# Altium project USB-C Power.PrjPcb (part 1 of 2)
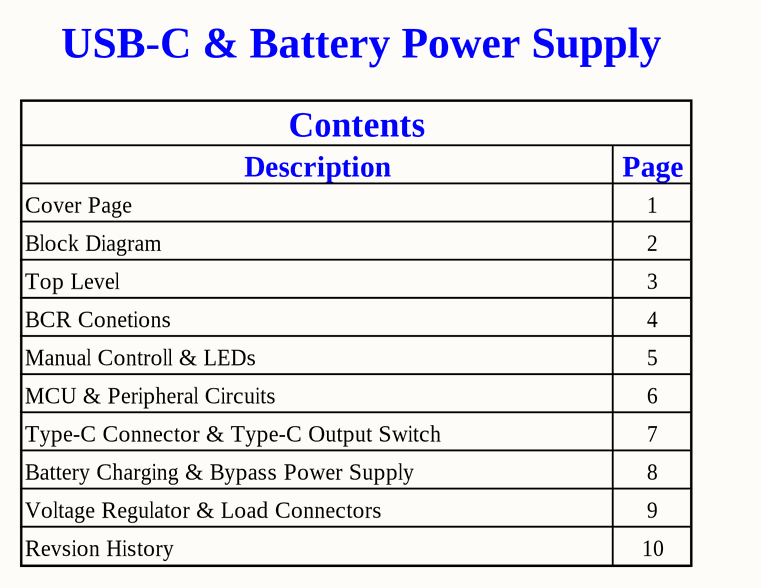
[diagram p0: Cover_Page.SchDoc]
DrawnBy: Yun-Chien Chen; Project: USB-C & Battery Power Supply; Revision: 01
11 sheets, 234 parts. Net scope: hierarchical (ports join the sheet entries above them; power ports are global).
Board file: USB-C Power.PcbDoc
Sheets:
  Cover_Page.SchDoc
  Block_Diagram.SchDoc
  Top_Level.SchDoc
    PD Controll & LEDs = PD_Controll_and_LEDs.SchDoc
    MCU & Peripheral Circuits = MCU_and_Peripheral_Circuits.SchDoc
    Type-C Connector & PD Switch = Type-C_Connector_and_PD_Switch.SchDoc
    PD BCR Connections = PD_BCR_Connections.SchDoc
    Battery & Bypass Controller Connectons = Battery_and_Bypass_Controller_Connectons.SchDoc
    Voltage Regulator & Load Connectors = Voltage_Regulator_and_Load_Connectors.SchDoc
    Battery Charging & Bypass Power Supply = Battery_Charging_and_Bypass_Power_Supply.SchDoc
  Revision_History.SchDoc

## Sheet Cover_Page.SchDoc: Cover Page
size 292 x 193 mm; SheetNumber: 1; SheetTotal: 12; SheetSize: A4

### Notes on the sheet
- USB-C & Battery Power Supply
- Project :
- Size:
- Title:
- Drawn by:
- Variant:
- Rev:
- Date:
- Sheet:
- of

## Sheet Block_Diagram.SchDoc: Block Diagram
size 292 x 193 mm; SheetNumber: 2; SheetTotal: 12; SheetSize: A4

### Notes on the sheet
- Project :
- Size:
- Title:
- Drawn by:
- Variant:
- Rev:
- Date:
- Sheet:
- of

## Sheet Top_Level.SchDoc: Top Level
size 292 x 193 mm; SheetNumber: 3; SheetTotal: 11; SheetSize: A4
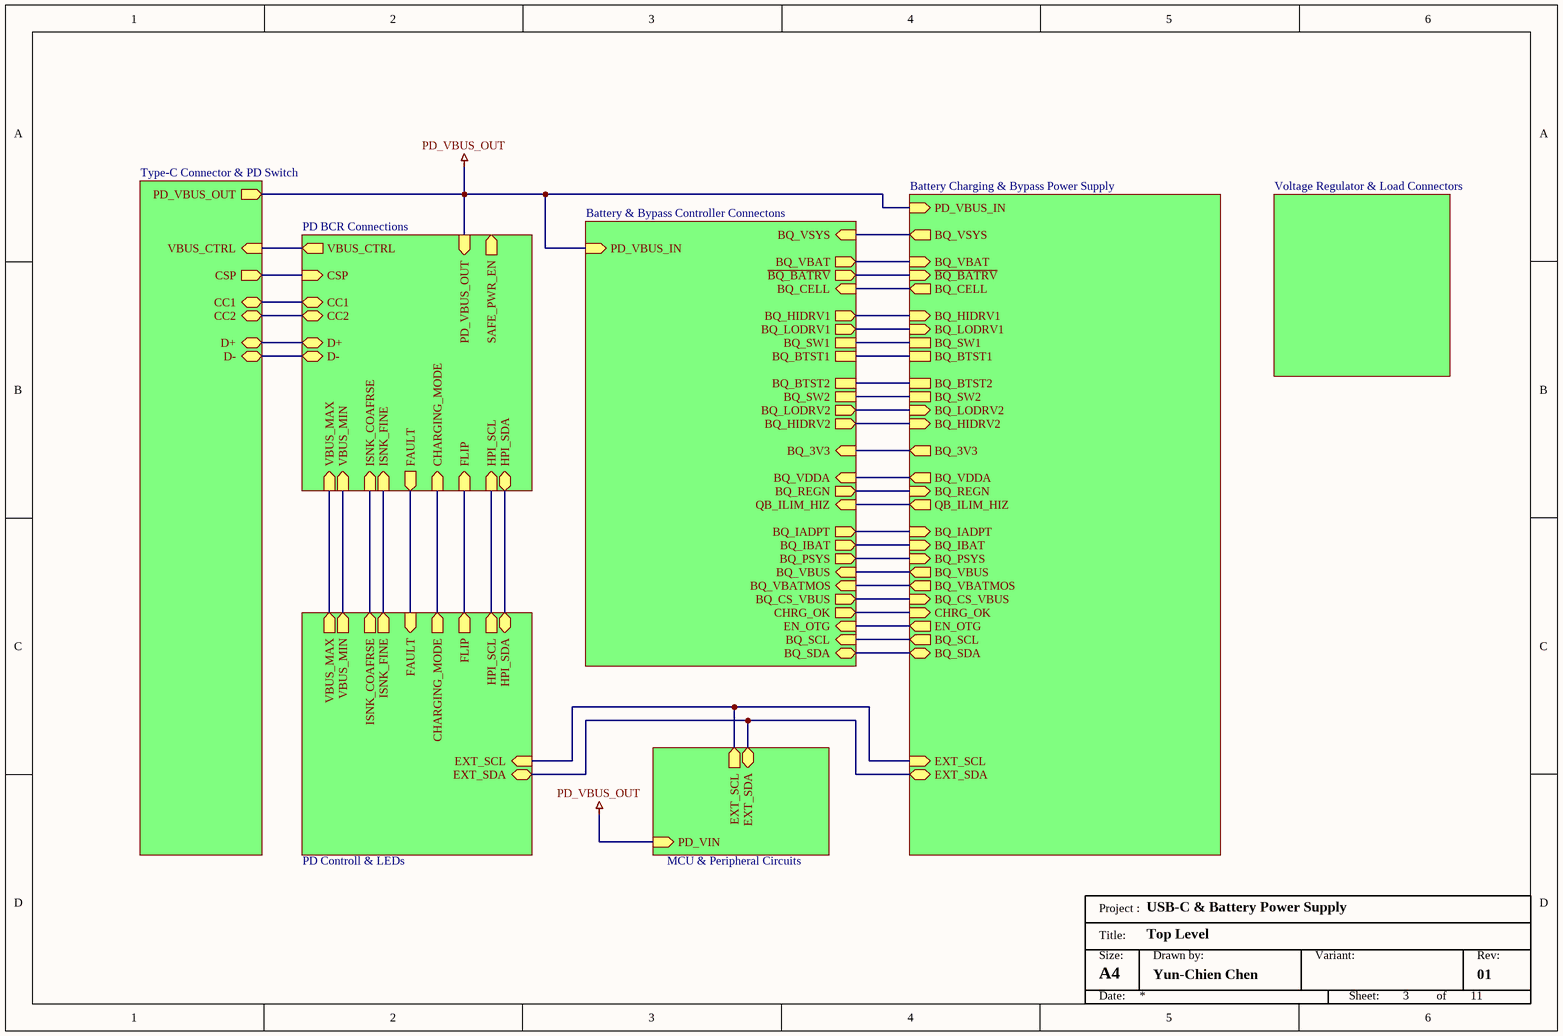
[diagram p1: Top_Level.SchDoc]

### Sub-sheets
Battery & Bypass Controller Connectons = Battery_and_Bypass_Controller_Connectons.SchDoc: CHRG_OK (out), EN_OTG (in), PD_VBUS_IN (in), BQ_3V3 (in), BQ_VDDA (in), QB_ILIM_HIZ (in), BQ_VBUS (in), BQ_IADPT (out), BQ_IBAT (out), BQ_PSYS (out), BQ_REGN (out), BQ_CS_VBUS (out), BQ_HIDRV1 (out), BQ_HIDRV2 (out), BQ_BTST1, BQ_BTST2, BQ_LODRV1 (out), BQ_LODRV2 (out), BQ_SW1, BQ_SW2, BQ_VBAT (out), ~{BQ_BATRV} (out), BQ_VBATMOS (in), BQ_CELL (in), BQ_SDA (bidir), BQ_SCL (in), BQ_VSYS (in)
Battery Charging & Bypass Power Supply = Battery_Charging_and_Bypass_Power_Supply.SchDoc: EXT_SCL (in), EXT_SDA (bidir), BQ_3V3 (out), BQ_VBAT (in), BQ_SCL (out), CHRG_OK (in), EN_OTG (out), QB_ILIM_HIZ (out), PD_VBUS_IN (in), BQ_IADPT (in), BQ_IBAT (in), BQ_PSYS (in), BQ_REGN (in), ~{BQ_BATRV} (in), BQ_VBATMOS (out), BQ_CELL (out), BQ_SDA (bidir), BQ_VDDA (out), BQ_CS_VBUS (in), BQ_HIDRV1 (in), BQ_LODRV1 (in), BQ_SW1, BQ_BTST1, BQ_BTST2, BQ_SW2, BQ_LODRV2 (in), BQ_HIDRV2 (in), BQ_VSYS (out), BQ_VBUS (out)
MCU & Peripheral Circuits = MCU_and_Peripheral_Circuits.SchDoc: EXT_SDA (bidir), PD_VIN (in), EXT_SCL (out)
PD BCR Connections = PD_BCR_Connections.SchDoc: CC1 (bidir), CC2 (bidir), CSP (in), VBUS_CTRL (out), FAULT (out), CHARGING_MODE (in), FLIP (in), VBUS_MAX (in), VBUS_MIN (in), ISNK_FINE (in), ISNK_COAFRSE (in), HPI_SCL (in), HPI_SDA (bidir), D+ (bidir), D- (bidir), PD_VBUS_OUT (in), SAFE_PWR_EN (out)
PD Controll & LEDs = PD_Controll_and_LEDs.SchDoc: CHARGING_MODE (out), EXT_SCL (in), EXT_SDA (bidir), FLIP (out), HPI_SCL (out), HPI_SDA (bidir), VBUS_MAX (out), VBUS_MIN (out), ISNK_FINE (out), ISNK_COAFRSE (out), FAULT (in)
Type-C Connector & PD Switch = Type-C_Connector_and_PD_Switch.SchDoc: D+ (bidir), D- (bidir), CC1 (bidir), CC2 (bidir), VBUS_CTRL (in), PD_VBUS_OUT (out), CSP (out)
Voltage Regulator & Load Connectors = Voltage_Regulator_and_Load_Connectors.SchDoc: no entries

### Nets
BQ_3V3: sheet Battery & Bypass Controller Connectons/BQ_3V3, sheet Battery Charging & Bypass Power Supply/BQ_3V3
BQ_CS_VBUS: sheet Battery & Bypass Controller Connectons/BQ_CS_VBUS, sheet Battery Charging & Bypass Power Supply/BQ_CS_VBUS
PD_VBUS_OUT: sheet MCU & Peripheral Circuits/PD_VIN, sheet Type-C Connector & PD Switch/PD_VBUS_OUT, sheet PD BCR Connections/PD_VBUS_OUT, sheet Battery & Bypass Controller Connectons/PD_VBUS_IN, sheet Battery Charging & Bypass Power Supply/PD_VBUS_IN  [project net PD_VBUS_IN]
RETURN_GND: sheet Type-C Connector & PD Switch/CSP, sheet PD BCR Connections/CSP
~{BQ_BATRV}: sheet Battery & Bypass Controller Connectons/~{BQ_BATRV}, sheet Battery Charging & Bypass Power Supply/~{BQ_BATRV}
BQ_BTST1: sheet Battery & Bypass Controller Connectons/BQ_BTST1, sheet Battery Charging & Bypass Power Supply/BQ_BTST1
BQ_BTST2: sheet Battery & Bypass Controller Connectons/BQ_BTST2, sheet Battery Charging & Bypass Power Supply/BQ_BTST2
BQ_CELL: sheet Battery & Bypass Controller Connectons/BQ_CELL, sheet Battery Charging & Bypass Power Supply/BQ_CELL
BQ_HIDRV1: sheet Battery & Bypass Controller Connectons/BQ_HIDRV1, sheet Battery Charging & Bypass Power Supply/BQ_HIDRV1
BQ_HIDRV2: sheet Battery & Bypass Controller Connectons/BQ_HIDRV2, sheet Battery Charging & Bypass Power Supply/BQ_HIDRV2
BQ_IADPT: sheet Battery & Bypass Controller Connectons/BQ_IADPT, sheet Battery Charging & Bypass Power Supply/BQ_IADPT
BQ_IBAT: sheet Battery & Bypass Controller Connectons/BQ_IBAT, sheet Battery Charging & Bypass Power Supply/BQ_IBAT
BQ_LODRV1: sheet Battery & Bypass Controller Connectons/BQ_LODRV1, sheet Battery Charging & Bypass Power Supply/BQ_LODRV1
BQ_LODRV2: sheet Battery & Bypass Controller Connectons/BQ_LODRV2, sheet Battery Charging & Bypass Power Supply/BQ_LODRV2
BQ_PSYS: sheet Battery & Bypass Controller Connectons/BQ_PSYS, sheet Battery Charging & Bypass Power Supply/BQ_PSYS
BQ_REGN: sheet Battery & Bypass Controller Connectons/BQ_REGN, sheet Battery Charging & Bypass Power Supply/BQ_REGN
BQ_SCL: sheet Battery & Bypass Controller Connectons/BQ_SCL, sheet Battery Charging & Bypass Power Supply/BQ_SCL
BQ_SDA: sheet Battery & Bypass Controller Connectons/BQ_SDA, sheet Battery Charging & Bypass Power Supply/BQ_SDA
BQ_SW1: sheet Battery & Bypass Controller Connectons/BQ_SW1, sheet Battery Charging & Bypass Power Supply/BQ_SW1
BQ_SW2: sheet Battery & Bypass Controller Connectons/BQ_SW2, sheet Battery Charging & Bypass Power Supply/BQ_SW2
BQ_VBATMOS: sheet Battery & Bypass Controller Connectons/BQ_VBATMOS, sheet Battery Charging & Bypass Power Supply/BQ_VBATMOS
BQ_VBUS: sheet Battery & Bypass Controller Connectons/BQ_VBUS, sheet Battery Charging & Bypass Power Supply/BQ_VBUS
CC1: sheet Type-C Connector & PD Switch/CC1, sheet PD BCR Connections/CC1
CC2: sheet Type-C Connector & PD Switch/CC2, sheet PD BCR Connections/CC2
CHARGING_MODE: sheet PD Controll & LEDs/CHARGING_MODE, sheet PD BCR Connections/CHARGING_MODE
CHRG_OK: sheet Battery & Bypass Controller Connectons/CHRG_OK, sheet Battery Charging & Bypass Power Supply/CHRG_OK
D+: sheet Type-C Connector & PD Switch/D+, sheet PD BCR Connections/D+
D-: sheet Type-C Connector & PD Switch/D-, sheet PD BCR Connections/D-
EN_OTG: sheet Battery & Bypass Controller Connectons/EN_OTG, sheet Battery Charging & Bypass Power Supply/EN_OTG
FAULT: sheet PD Controll & LEDs/FAULT, sheet PD BCR Connections/FAULT
HPI_SCL: sheet PD Controll & LEDs/HPI_SCL, sheet PD BCR Connections/HPI_SCL
HPI_SDA: sheet PD Controll & LEDs/HPI_SDA, sheet PD BCR Connections/HPI_SDA
I2C2_SCL: sheet PD Controll & LEDs/EXT_SCL, sheet MCU & Peripheral Circuits/EXT_SCL, sheet Battery Charging & Bypass Power Supply/EXT_SCL
I2C2_SDA: sheet PD Controll & LEDs/EXT_SDA, sheet MCU & Peripheral Circuits/EXT_SDA, sheet Battery Charging & Bypass Power Supply/EXT_SDA
ISNK_COAFRSE: sheet PD Controll & LEDs/ISNK_COAFRSE, sheet PD BCR Connections/ISNK_COAFRSE
ISNK_FINE: sheet PD Controll & LEDs/ISNK_FINE, sheet PD BCR Connections/ISNK_FINE
QB_ILIM_HIZ: sheet Battery & Bypass Controller Connectons/QB_ILIM_HIZ, sheet Battery Charging & Bypass Power Supply/QB_ILIM_HIZ
SWD_CLK: sheet PD Controll & LEDs/FLIP, sheet PD BCR Connections/FLIP
VBAT: sheet Battery & Bypass Controller Connectons/BQ_VBAT, sheet Battery Charging & Bypass Power Supply/BQ_VBAT
VBUS_CTRL: sheet Type-C Connector & PD Switch/VBUS_CTRL, sheet PD BCR Connections/VBUS_CTRL
VBUS_MAX: sheet PD Controll & LEDs/VBUS_MAX, sheet PD BCR Connections/VBUS_MAX
VBUS_MIN: sheet PD Controll & LEDs/VBUS_MIN, sheet PD BCR Connections/VBUS_MIN
VDDA: sheet Battery & Bypass Controller Connectons/BQ_VDDA, sheet Battery Charging & Bypass Power Supply/BQ_VDDA
VSYS: sheet Battery & Bypass Controller Connectons/BQ_VSYS, sheet Battery Charging & Bypass Power Supply/BQ_VSYS

### Notes on the sheet
- Project :
- Size:
- Title:
- Drawn by:
- Variant:
- Rev:
- Date:
- Sheet:
- of

## Sheet PD_Controll_and_LEDs.SchDoc: Manual Controll & LEDs
size 292 x 193 mm; SheetNumber: 6; SheetTotal: 11; SheetSize: A4
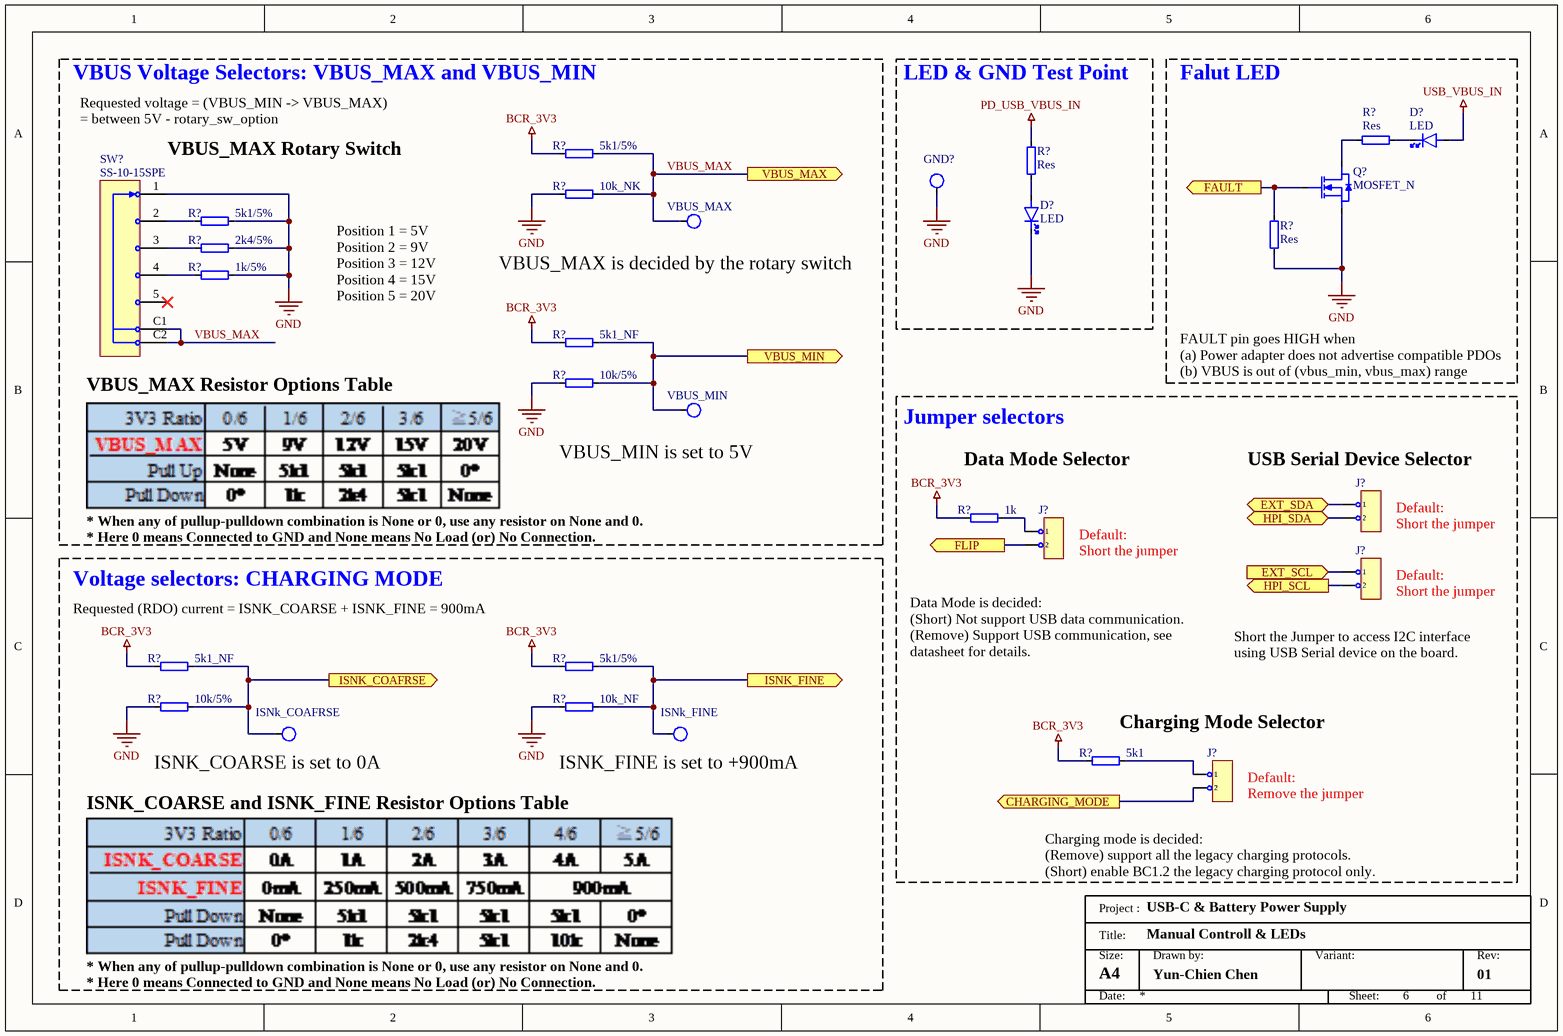
[diagram p2: PD_Controll_and_LEDs.SchDoc]

### Parts
(Parts that share a designator on the sheet are numbered #1, #2 ... from top to bottom, then left to right.)
D?#1  LED  [0603_LED]
D?#2  LED  [0603_LED]
GND?  DIP_small_Black  [TestPoint_dip_big]  (value not drawn)
ISNk_COAFRSE  SMD_25mil  [TestPoint_dip_big]  (value not drawn)
ISNk_FINE  SMD_25mil  [TestPoint_dip_big]  (value not drawn)
J?#1  Jumper_2x1  [Dupont_Header_(Female)_2.54_2x1]  (value not drawn)
J?#2  Jumper_2x1  [Dupont_Header_(Female)_2.54_2x1]  (value not drawn)
J?#3  Jumper_2x1  [Dupont_Header_(Female)_2.54_2x1]  (value not drawn)
J?#4  Jumper_2x1  [Dupont_Header_(Female)_2.54_2x1]  (value not drawn)
Q?#1  MOSFET_N  [SOT-523-3]
R?#1  Res  [0603_Res]
R?#2  Res  [0603_Res]
R?#3  5k1/5%  [0603_Res]
R?#4  10k_NK  [0603_Res]
R?#5  Res  [0603_Res]
R?#6  5k1/5%  [0603_Res]
R?#7  2k4/5%  [0603_Res]
R?#8  1k/5%  [0603_Res]
R?#9  5k1_NF  [0603_Res]
R?#10  10k/5%  [0603_Res]
R?#11  1k  [0603_Res]
R?#12  5k1_NF  [0603_Res]
R?#13  5k1/5%  [0603_Res]
R?#14  10k/5%  [0603_Res]
R?#15  10k_NF  [0603_Res]
R?#16  5k1  [0603_Res]
SW?  SS-10-15SPE
VBUS_MAX  SMD_25mil  [TestPoint_dip_big]  (value not drawn)
VBUS_MIN  SMD_25mil  [TestPoint_dip_big]  (value not drawn)

### Blocks framed on the sheet
VBUS Voltage Selectors: VBUS_MAX and VBUS_MIN: R?#3 R?#4 R?#6-R?#10 SW? VBUS_MAX VBUS_MIN
LED & GND Test Point: D?#2 GND? R?#1
Falut LED: D?#1 Q?#1 R?#2 R?#5
Jumper selectors: J?#1-J?#4 R?#11 R?#16
Voltage selectors: CHARGING MODE: ISNk_COAFRSE ISNk_FINE R?#12-R?#15

### Ports
CHARGING_MODE (out), EXT_SCL (in), EXT_SDA (bidir), FAULT (out), FLIP (out), HPI_SCL (out), HPI_SDA (bidir), ISNK_COAFRSE (out), ISNK_FINE (out), VBUS_MAX (out), VBUS_MIN (out)

### Nets
BCR_3V3: R?#3.1 R?#9.1 R?#11.1 R?#12.1 R?#13.1 R?#16.1
GND: D?#2.2(K) GND?.1 Q?#1.3(S) R?#4.1 R?#5.2 R?#6.2 R?#7.2 R?#8.2 R?#10.1 R?#14.1 R?#15.1 SW?.1
PD_USB_VBUS_IN: R?#1.1
USB_VBUS_IN: D?#1.1(A)
CHARGING_MODE: J?#4.2 ; port CHARGING_MODE
FAULT: Q?#1.2(G) R?#5.1 ; port FAULT
HPI_SCL: J?#3.2 ; port HPI_SCL
HPI_SDA: J?#1.2 ; port HPI_SDA
I2C2_SCL: J?#3.1 ; port EXT_SCL
I2C2_SDA: J?#1.1 ; port EXT_SDA
ISNK_COAFRSE: ISNk_COAFRSE.1 R?#12.2 R?#14.2 ; port ISNK_COAFRSE
ISNK_FINE: ISNk_FINE.1 R?#13.2 R?#15.2 ; port ISNK_FINE
SWD_CLK: J?#2.2 ; port FLIP
VBUS_MAX: R?#3.2 R?#4.2 SW?.C1 SW?.C2 VBUS_MAX.1 ; port VBUS_MAX
VBUS_MIN: R?#9.2 R?#10.2 VBUS_MIN.1 ; port VBUS_MIN
NetD?#1_2: D?#1.2(K) R?#2.1
NetD?#2_1: D?#2.1(A) R?#1.2
NetJ?#2_1: J?#2.1 R?#11.2
NetJ?#4_1: J?#4.1 R?#16.2
NetQ?#1_1: Q?#1.1(D) R?#2.2
NetR?#6_1: R?#6.1 SW?.2
NetR?#7_1: R?#7.1 SW?.3
NetR?#8_1: R?#8.1 SW?.4

Not connected (* = marked no-connect by the designer): SW? 5*

### Notes on the sheet
- Requested voltage = (VBUS_MIN -> VBUS_MAX)
  = between 5V - rotary_sw_option
- VBUS_MAX Rotary Switch
- Position 1 = 5V
  Position 2 = 9V
  Position 3 = 12V
  Position 4 = 15V
  Position 5 = 20V
- (near VBUS_MAX) VBUS_MAX is decided by the rotary switch
- FAULT pin goes HIGH when
  (a) Power adapter does not advertise compatible PDOs
  (b) VBUS is out of (vbus_min, vbus_max) range
- (near SW?) VBUS_MAX Resistor Options Table
- (near VBUS_MIN) VBUS_MIN is set to 5V
- Data Mode Selector
- (near J?#1) USB Serial Device Selector
- * When any of pullup-pulldown combination is None or 0, use any resistor on None and 0.
  * Here 0 means Connected to GND and None means No Load (or) No Connection.
- (near J?#2) Default:
  Short the jumper
- (near J?#1) Default:
  Short the jumper
- (near R?#12) Requested (RDO) current = ISNK_COARSE + ISNK_FINE = 900mA
- Data Mode is decided:
  (Short) Not support USB data communication.
  (Remove) Support USB communication, see datasheet for details.
- (near J?#3) Short the Jumper to access I2C interface using USB Serial device on the board.
- (near J?#3) Default:
  Short the jumper
- (near ISNk_COAFRSE) ISNK_COARSE is set to 0A
- (near ISNk_FINE) ISNK_FINE is set to +900mA
- Charging Mode Selector
- ISNK_COARSE and ISNK_FINE Resistor Options Table
- (near J?#4) Default:
  Remove the jumper
- (near J?#4) Charging mode is decided:
  (Remove) support all the legacy charging protocols.
  (Short) enable BC1.2 the legacy charging protocol only.
- Project :
- Size:
- Title:
- Drawn by:
- Variant:
- Rev:
- Date:
- Sheet:
- of

### Library data of the parts
D?#1 D?#2 = LED: General LED; Mfr. #: *; Mfr.: *; Distributor_Link: *; Datasheet: *; Distributor #: *
GND? ISNk_COAFRSE ISNk_FINE VBUS_MAX VBUS_MIN = Test_Point: General test point; Mfr. #: N/A; Mfr.: N/A; Distributor_Link: N/A; Datasheet: N/A; Distributor #: N/A
J?#1-J?#4 = Jumper_2x1: General Jumper 2x1; Mfr. #: *; Mfr.: *; Distributor_Link: *; Datasheet: *; Distributor #: *
Q?#1 = MOSFET_N: General n channel mosfet; Mfr. #: *; Mfr.: *; Distributor_Link: *; Datasheet: *; Distributor #: *
R?#1-R?#16 = Res: General Resistor; Mfr. #: *; Mfr.: *; Distributor_Link: *; Datasheet: *; Distributor #: *
SW? = SS-10-15SPE: SW-SP5T

## Sheet MCU_and_Peripheral_Circuits.SchDoc: MCU & Peripheral Circuits
size 292 x 193 mm; SheetNumber: 7; SheetTotal: 12; SheetSize: A4
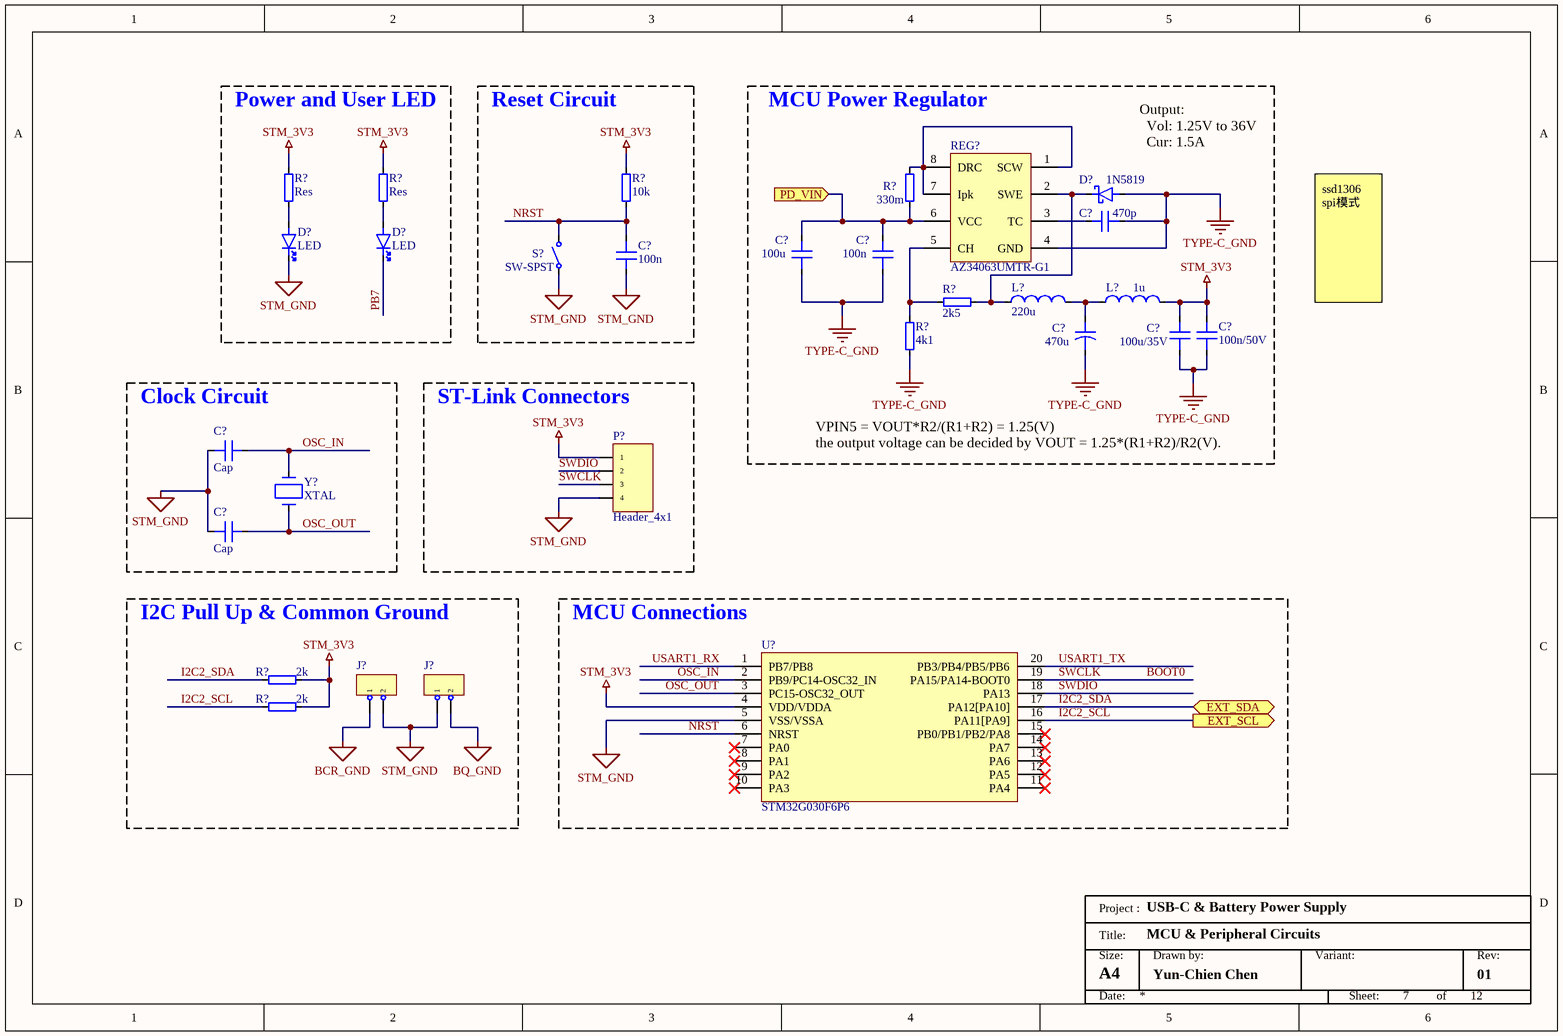
[diagram p3: MCU_and_Peripheral_Circuits.SchDoc]

### Parts
(Parts that share a designator on the sheet are numbered #1, #2 ... from top to bottom, then left to right.)
C?#1  470p  [0805_Cap]
C?#2  100u  [0805_Cap]
C?#3  100n  [0805_Cap]
C?#4  100n  [0805_Cap]
C?#5  470u
C?#6  100u/35V  [0805_Cap]
C?#7  100n/50V  [0805_Cap]
C?#8  Cap  [0805_Cap]
C?#9  Cap  [0805_Cap]
D?#3  1N5819
D?#4  LED  [0603_LED]
D?#5  LED  [0603_LED]
J?#5  Jumper_2x1  [Dupont_Header_(Female)_2.54_2x1]  (value not drawn)
J?#6  Jumper_2x1  [Dupont_Header_(Female)_2.54_2x1]  (value not drawn)
L?#1  220u  [1212_Ind]
L?#2  1u  [1212_Ind]
P?#1  Header_4x1  [XT60PW-M]
R?#17  330m  [0603_Res]
R?#18  Res  [0603_Res]
R?#19  Res  [0603_Res]
R?#20  10k  [0603_Res]
R?#21  2k5  [0603_Res]
R?#22  4k1  [0603_Res]
R?#23  2k  [0603_Res]
R?#24  2k  [0603_Res]
REG?#1  AZ34063UMTR-G1  [SOIC-8]
S?  SW-SPST
U?#1  STM32G030F6P6  [TSSOP-20]
Y?  XTAL

### Blocks framed on the sheet
Power and User LED: D?#4 D?#5 R?#18 R?#19
Reset Circuit: C?#4 R?#20 S?
MCU Power Regulator: C?#1-C?#3 C?#5-C?#7 D?#3 L?#1 L?#2 R?#17 R?#21 R?#22 REG?#1
Clock Circuit: C?#8 C?#9 Y?
ST-Link Connectors: P?#1
I2C Pull Up & Common Ground: J?#5 J?#6 R?#23 R?#24
MCU Connections: U?#1

### Ports
EXT_SCL (out), EXT_SDA (bidir), PD_VIN (in)

### Nets
BCR_GND: J?#5.1
BQ_GND: J?#6.2
PD_VBUS_IN: C?#2.1 C?#3.1 R?#17.2 REG?#1.6(VCC) ; port PD_VIN
STM_3V3: C?#6.1 C?#7.1 L?#2.2 P?#1.1 R?#18.2 R?#19.2 R?#20.2 R?#23.2 R?#24.2 U?#1.4(VDD/VDDA)
STM_GND: C?#4.1 C?#8.2 C?#9.2 D?#4.2(K) J?#5.2 J?#6.1 P?#1.4 S?.1 U?#1.5(VSS/VSSA)
TYPE-C_GND: C?#1.2 C?#2.2 C?#3.2 C?#5.2 C?#6.2 C?#7.2 D?#3.1(A) R?#22.1 REG?#1.4(GND)
BOOT0: P?#1.3 U?#1.19(PA15/PA14-BOOT0)  [also labelled SWCLK]
I2C2_SCL: R?#24.1 U?#1.16(PA11[PA9]) ; port EXT_SCL
I2C2_SDA: R?#23.1 U?#1.17(PA12[PA10]) ; port EXT_SDA
NRST: C?#4.2 R?#20.1 S?.2 U?#1.6(NRST)
OSC_IN: C?#8.1 U?#1.2(PB9/PC14-OSC32_IN) Y?.2
OSC_OUT: C?#9.1 U?#1.3(PC15-OSC32_OUT) Y?.1
PB7: D?#5.2(K)
SWDIO: P?#1.2 U?#1.18(PA13)
USART1_RX: U?#1.1(PB7/PB8)
USART1_TX: U?#1.20(PB3/PB4/PB5/PB6)
NetC?#1_1: C?#1.1 REG?#1.3(TC)
NetC?#5_1: C?#5.1 L?#1.2 L?#2.1
NetD?#3_2: D?#3.2(K) L?#1.1 R?#21.1 REG?#1.2(SWE)
NetD?#4_1: D?#4.1(A) R?#18.1
NetD?#5_1: D?#5.1(A) R?#19.1
NetR?#17_1: R?#17.1 REG?#1.1(SCW) REG?#1.7(Ipk) REG?#1.8(DRC)
NetR?#21_2: R?#21.2 R?#22.2 REG?#1.5(CH)

Not connected (* = marked no-connect by the designer): U?#1 7(PA0)* 8(PA1)* 9(PA2)* 10(PA3)* 11(PA4)* 12(PA5)* 13(PA6)* 14(PA7)* 15(PB0/PB1/PB2/PA8)*

### Notes on the sheet
- (near D?#3) Output:
  Vol: 1.25V to 36V
  Cur: 1.5A
- ssd1306 spi模式
- VPIN5 = VOUT*R2/(R1+R2) = 1.25(V)
  the output voltage can be decided by VOUT = 1.25*(R1+R2)/R2(V).
- Project :
- Size:
- Title:
- Drawn by:
- Variant:
- Rev:
- Date:
- Sheet:
- of

### Library data of the parts
C?#1-C?#4 C?#6-C?#9 = Cap: General capacitor (non-polarized); Mfr. #: *; Mfr.: *; Distributor_Link: *; Datasheet: *; Distributor #: *
C?#5 = Cap_2: General capacitor (with polarity); Mfr. #: *; Mfr.: *; Distributor_Link: *; Datasheet: *; Distributor #: *
D?#3 = Diode_Schottky: General schottky diode; Mfr. #: *; Mfr.: *; Distributor_Link: *; Datasheet: *; Distributor #: *
D?#4 D?#5 = LED: General LED; Mfr. #: *; Mfr.: *; Distributor_Link: *; Datasheet: *; Distributor #: *
J?#5 J?#6 = Jumper_2x1: General Jumper 2x1; Mfr. #: *; Mfr.: *; Distributor_Link: *; Datasheet: *; Distributor #: *
L?#1 L?#2 = Inductor: General Inductor; Mfr. #: *; Mfr.: *; Distributor_Link: *; Datasheet: *; Distributor #: *
P?#1 = Header_4x1: General header 4x1; Mfr. #: *; Mfr.: *; Distributor_Link: *; Datasheet: *; Distributor #: *
R?#17-R?#24 = Res: General Resistor; Mfr. #: *; Mfr.: *; Distributor_Link: *; Datasheet: *; Distributor #: *
REG?#1 = AZ34063UMTR-G1: USB Interface IC USB Type-C port controller (BCR) CYPD3177; Mfr.: Diodes Incorporated; Distributor_Link: https://www.mouser.tw/ProductDetail/Diodes-Incorporated/AZ34063UMTR-G1?qs=FKu9oBikfSmOGMlC%2Fa3O3g%3D%3D; Mfr. #: AZ34063UMTR-G1; Datasheet: https://www.diodes.com/assets/Datasheets/AZ34063U.pdf; Distributor #: 621-AZ34063UMTR-G1
S? = SW-SPST: General Single-Pole, Single-Throw Switch; Mfr. #: *; Mfr.: *; Distributor_Link: *; Datasheet: *; Distributor #: *
U?#1 = STM32G030F6P6: ARM Microcontrollers - MCU Mainstream Value-Line Arm Cortex-M0+ MCU 32 Kbytes of Flash 8 Kbytes RAM, 64 MHz; Mfr.: STMicroelectronics; Distributor_Link: https://www.mouser.tw/ProductDetail/STMicroelectronics/STM32G030F6P6?qs=uwxL4vQweFOQRcVHghCbHA%3D%3D; Mfr. #: STM32G030F6P6; Datasheet: https://www.mouser.tw/datasheet/2/389/stm32g030c6-1826662.pdf; Distributor #: 511-STM32G030F6P6
Y? = XTAL: General Crystals; Mfr. #: *; Mfr.: *; Distributor_Link: *; Datasheet: *; Distributor #: *

## Sheet Type-C_Connector_and_PD_Switch.SchDoc: Type-C Connector & PD Switch
size 292 x 193 mm; SheetNumber: 4; SheetTotal: 12; SheetSize: A4
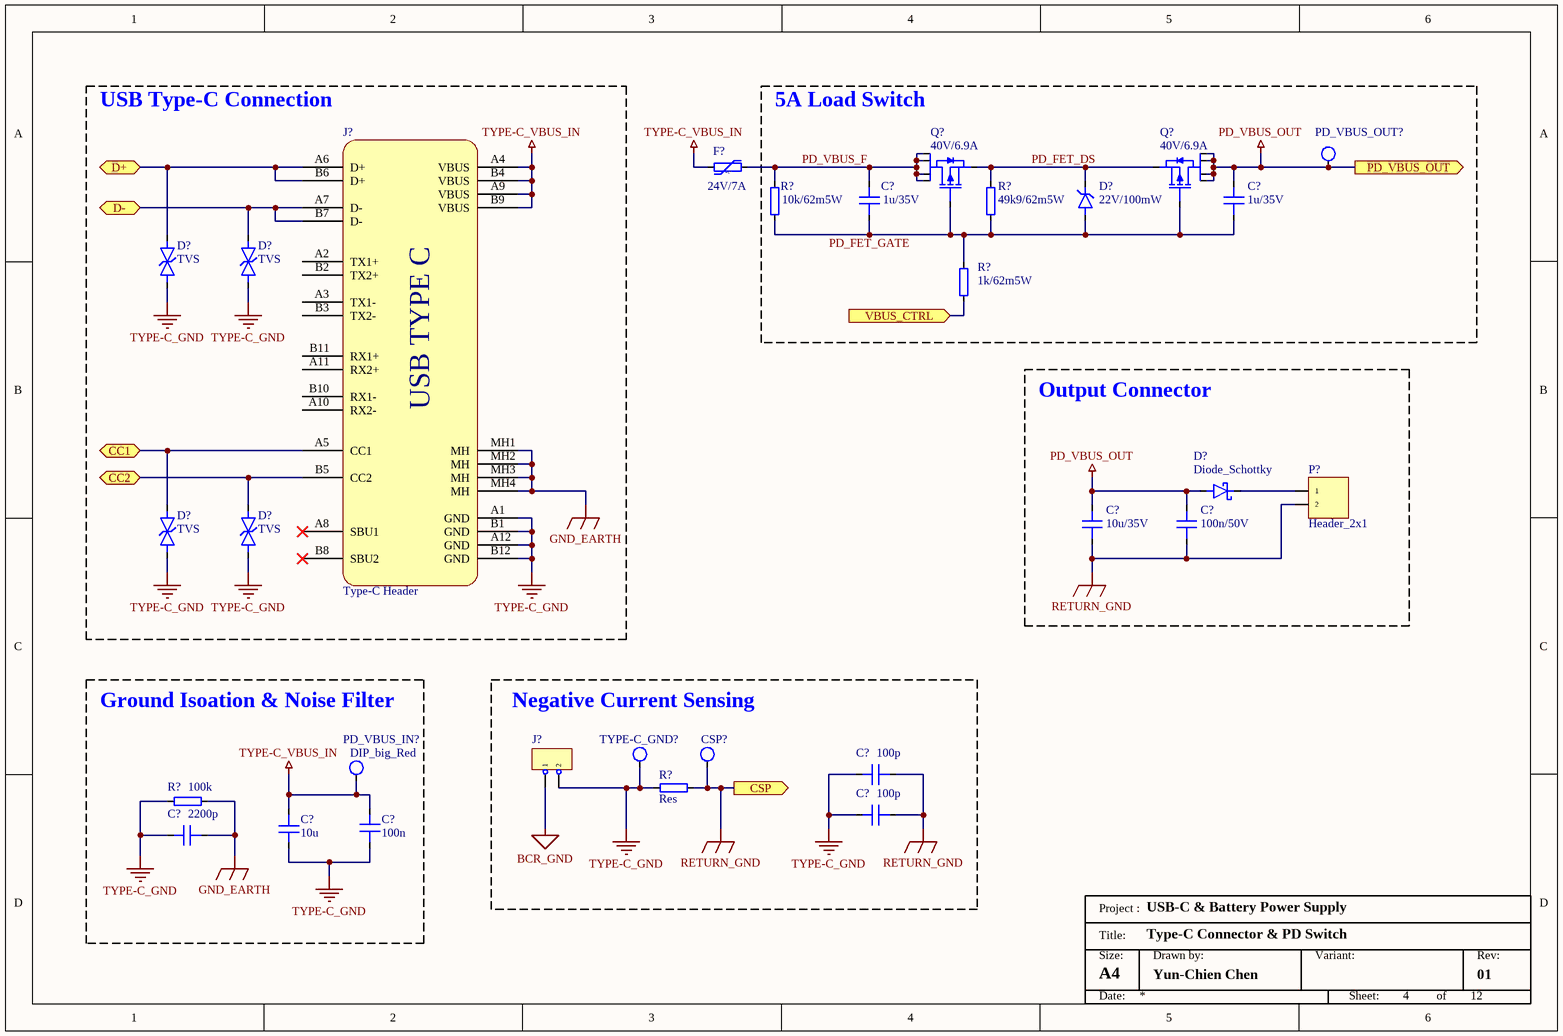
[diagram p4: Type-C_Connector_and_PD_Switch.SchDoc]

### Parts
(Parts that share a designator on the sheet are numbered #1, #2 ... from top to bottom, then left to right.)
C?#10  1u/35V  [0805_Cap]
C?#11  1u/35V  [0805_Cap]
C?#12  10u/35V  [0805_Cap]
C?#13  100n/50V  [0402_CAP]
C?#14  100p  [0805_Cap]
C?#15  100p  [0805_Cap]
C?#16  100n  [0805_Cap]
C?#17  2200p  [0805_Cap]
C?#18  10u  [0805_Cap]
CSP?  SMD_25mil  [TestPoint_smd_25mil]  (value not drawn)
D?#6  22V/100mW  [SOD-923-2]
D?#7  TVS  [SOD-523]
D?#8  TVS  [SOD-523]
D?#9  Diode_Schottky
D?#10  TVS  [SOD-523]
D?#11  TVS  [SOD-523]
F?  24V/7A  [2920_PTC]
J?#7  Type-C Header
J?#8  Jumper_2x1  [Dupont_Header_(Female)_2.54_2x1]  (value not drawn)
P?#2  Header_2x1  [XT60PW-M]
PD_VBUS_IN?  DIP_big_Red  [TestPoint_dip_big]
PD_VBUS_OUT?  DIP_big_Red  [TestPoint_dip_big]  (value not drawn)
Q?#2  40V/6.9A  [TSOP-6]
Q?#3  40V/6.9A  [TSOP-6]
R?#25  10k/62m5W  [0402_Res]
R?#26  49k9/62m5W  [0402_Res]
R?#27  1k/62m5W  [0402_Res]
R?#28  Res  [0603_Res]
R?#29  100k  [0603_Res]
TYPE-C_GND?  SMD_25mil  [TestPoint_smd_25mil]  (value not drawn)

### Blocks framed on the sheet
USB Type-C Connection: D?#7 D?#8 D?#10 D?#11 J?#7
5A Load Switch: C?#10 C?#11 D?#6 PD_VBUS_OUT? Q?#2 Q?#3 R?#25-R?#27
Output Connector: C?#12 C?#13 D?#9 P?#2
Ground Isoation & Noise Filter: C?#16-C?#18 PD_VBUS_IN? R?#29
Negative Current Sensing: C?#14 C?#15 CSP? J?#8 R?#28 TYPE-C_GND?

### Ports
CC1 (bidir), CC2 (bidir), CSP (out), D+ (bidir), D- (bidir), PD_VBUS_OUT (out), VBUS_CTRL (in)

### Nets
BCR_GND: J?#8.1
GND_EARTH: C?#17.2 J?#7.MH1(MH) J?#7.MH2(MH) J?#7.MH3(MH) J?#7.MH4(MH) R?#29.2
PD_VBUS_OUT: C?#11.1 C?#12.1 C?#13.1 D?#9.1(A) PD_VBUS_OUT?.1 Q?#3.1(D1_1) Q?#3.2(D1_2) Q?#3.5(D1_3) Q?#3.6(D1_4) ; port PD_VBUS_OUT  [project net PD_VBUS_IN]
RETURN_GND: C?#12.2 C?#13.2 C?#14.2 C?#15.2 CSP?.1 P?#2.2 R?#28.2 ; port CSP
TYPE-C_GND: C?#14.1 C?#15.1 C?#16.2 C?#17.1 C?#18.1 D?#7.2(K) D?#8.1(A) D?#10.2(K) D?#11.2(K) J?#7.A1(GND) J?#7.A12(GND) J?#7.B1(GND) J?#7.B12(GND) J?#8.2 R?#28.1 R?#29.1 TYPE-C_GND?.1
TYPE-C_VBUS_IN: C?#16.1 C?#18.2 F?.1 J?#7.A4(VBUS) J?#7.A9(VBUS) J?#7.B4(VBUS) J?#7.B9(VBUS) PD_VBUS_IN?.1
CC1: D?#10.1(A) J?#7.A5(CC1) ; port CC1
CC2: D?#11.1(A) J?#7.B5(CC2) ; port CC2
D+: D?#7.1(A) J?#7.A6(D+) J?#7.B6(D+) ; port D+
D-: D?#8.2(K) J?#7.A7(D-) J?#7.B7(D-) ; port D-
PD_FET_DS: D?#6.2(K) Q?#2.4(S1) Q?#3.4(S1) R?#26.2
PD_FET_GATE: C?#10.2 C?#11.2 D?#6.1(A) Q?#2.3(G1) Q?#3.3(G1) R?#25.2 R?#26.1 R?#27.2
PD_VBUS_F: C?#10.1 F?.2 Q?#2.1(D1_1) Q?#2.2(D1_2) Q?#2.5(D1_3) Q?#2.6(D1_4) R?#25.1
VBUS_CTRL: R?#27.1 ; port VBUS_CTRL
NetD?#9_2: D?#9.2(K) P?#2.1

Not connected (* = marked no-connect by the designer): J?#7 A2(TX1+) A3(TX1-) A8(SBU1)* A10(RX2-) A11(RX2+) B2(TX2+) B3(TX2-) B8(SBU2)* B10(RX1-) B11(RX1+)

### Notes on the sheet
- Project :
- Size:
- Title:
- Drawn by:
- Variant:
- Rev:
- Date:
- Sheet:
- of
- (in symbol PTC) +t°
- (in symbol Type-C_20_Female) USB TYPE C

### Library data of the parts
C?#10 C?#11 = Cap: 25V 1uF Y5V ±20% 0805  Multilayer Ceramic Capacitors MLCC - SMD/SMT ROHS; Mfr. #: 0805F105M250NT; Mfr.: FH (Guangdong Fenghua Advanced Tech); Datasheet: https://datasheet.lcsc.com/lcsc/1810311214_FH--Guangdong-Fenghua-Advanced-Tech-0805F105M250NT_C89378.pdf; Distributor_Link: https://jlcpcb.com/partdetail/90558-0805F105M250NT/C89378; Distributor #: C89378
C?#12 = Cap: 25V 10uF X5R - Multilayer Ceramic Capacitors MLCC - SMD/SMT ROHS; Mfr. #: GRM21BR61E106KA73K; Mfr.: Murata Electronics; Datasheet: https://jlcpcb.com/parts/2nd/Capacitors/Multilayer_Ceramic_Capacitors_MLCC_SMD_SMT_33; Distributor_Link: https://jlcpcb.com/partdetail/4477883-GRM21BR61E106KA73K/C3909351; Distributor #: C3909351
C?#13 = Cap: 16V 100nF -20%~+80% 0402  Multilayer Ceramic Capacitors MLCC - SMD/SMT ROHS; Mfr. #: 0402F104Z160NT; Mfr.: FH (Guangdong Fenghua Advanced Tech); Datasheet: https://datasheet.lcsc.com/lcsc/2202131930_FH--Guangdong-Fenghua-Advanced-Tech-0402F104Z160NT_C2838746.pdf; Distributor_Link: https://jlcpcb.com/partdetail/3013916-0402F104Z160NT/C2838746; Distributor #: C2838746
C?#14-C?#18 = Cap: General capacitor (non-polarized); Mfr. #: *; Mfr.: *; Distributor_Link: *; Datasheet: *; Distributor #: *
CSP? PD_VBUS_IN? PD_VBUS_OUT? TYPE-C_GND? = Test_Point: General test point; Mfr. #: N/A; Mfr.: N/A; Distributor_Link: N/A; Datasheet: N/A; Distributor #: N/A
D?#6 = Diode_Zener: Zener Diodes CDZV22B is the 100mW type compact (1006 size) diode for voltage regulation.; Mfr. #: CDZVT2R22B; Mfr.: ROHM Semiconductor; Distributor_Link: https://www.mouser.tw/ProductDetail/ROHM-Semiconductor/CDZVT2R22B?qs=4v%252BiZTmLVHG6BDwFzUsoYg%3D%3D; Datasheet: https://www.rohm.com/datasheet?p=CDZV22B&dist=Mouser&media=referral&source=mouser.com&campaign=Mouser; Distributor #: 755-CDZVT2R22B
D?#7 D?#8 D?#10 D?#11 = TVS: General TVS; Mfr. #: *; Mfr.: *; Distributor_Link: *; Datasheet: *; Distributor #: *
D?#9 = Diode_Schottky: General schottky diode; Mfr. #: *; Mfr.: *; Distributor_Link: *; Datasheet: *; Distributor #: *
F? = PTC: Resettable Fuses - PPTC PTC SMD RESETTABLE FUSE; Mfr. #: 2920L700/24SLER; Mfr.: Littelfuse; Distributor_Link: https://www.mouser.tw/ProductDetail/Littelfuse/2920L700-24SLER?qs=7MVldsJ5UazQEVth1QGslQ%3D%3D; Datasheet: https://www.mouser.tw/datasheet/2/240/littelfuse_ptc_low_rho_datasheet_pdf-2956203.pdf; Distributor #: 576-2920L700/24SLER
J?#7 = Type-C_20_Female: Gerenal Type-C female header; MFR. #: *; Mfr.: *; Distributor_Link: *; Datasheet: *; Distributor #: *
J?#8 = Jumper_2x1: General Jumper 2x1; Mfr. #: *; Mfr.: *; Distributor_Link: *; Datasheet: *; Distributor #: *
P?#2 = Header_2x1: General header 2x1; Mfr. #: *; Mfr.: *; Distributor_Link: *; Datasheet: *; Distributor #: *
Q?#2 Q?#3 = MOSFET_P_1: MOSFET P Ch -40Vds 20Vgs AEC-Q101 Qualified; Mfr. #: SQ3419EV-T1_GE3; Mfr.: Vishay Semiconductors; Distributor_Link: https://www.mouser.tw/ProductDetail/Vishay-Semiconductors/SQ3419EV-T1_GE3?qs=Vcr9%2FL0R50hjQdrP75bU0Q%3D%3D&gclid=CjwKCAjwg-GjBhBnEiwAMUvNW2_QHlpdOmMyQk5t1a0eb3FLtCoKgaDvyU_lKGTsS4lC8mEsJurJAhoCUjcQAvD_BwE; Datasheet: https://www.vishay.com/doc?68210; Distributor #: 78-SQ3419EV-T1_GE3
R?#25 = Res: 62.5mW Thick Film Resistors ±100ppm/℃ ±5% 10kΩ 0402  Chip Resistor - Surface Mount ROHS; Mfr. #: CR-02JA6---10K; Mfr.: Viking Tech; Distributor_Link: https://jlcpcb.com/partdetail/VikingTech-CR_02JA6_10K/C2924170; Datasheet: https://datasheet.lcsc.com/lcsc/2111241930_Viking-Tech-CR-02JA6---10K_C2924170.pdf; Distributor #: C2924170
R?#26 = Res: 62.5mW Thick Film Resistors ±1% 49.9kΩ 0402  Chip Resistor - Surface Mount ROHS; Mfr. #: CR0402FF4992G; Mfr.: LIZ Elec; Distributor_Link: https://jlcpcb.com/partdetail/LizElec-CR0402FF4992G/C100457; Datasheet: https://datasheet.lcsc.com/lcsc/1810170232_LIZ-Elec-CR0402FF4992G_C100457.pdf; Distributor #: C100457
R?#27 = Res: 63mW ±5% 1kΩ 0402  Chip Resistor - Surface Mount ROHS; Mfr. #: CR0402J1K00Q10Z; Mfr.: Ever Ohms Tech; Distributor_Link: https://jlcpcb.com/partdetail/Ever_OhmsTech-CR0402J1K00Q10Z/C881213; Datasheet: https://datasheet.lcsc.com/lcsc/2010191904_Ever-Ohms-Tech-CR0402J1K00Q10Z_C881213.pdf; Distributor #: C881213
R?#28 R?#29 = Res: General Resistor; Mfr. #: *; Mfr.: *; Distributor_Link: *; Datasheet: *; Distributor #: *

## Sheet PD_BCR_Connections.SchDoc: PD BCR Connections
size 292 x 193 mm; SheetNumber: 5; SheetTotal: 11; SheetSize: A4
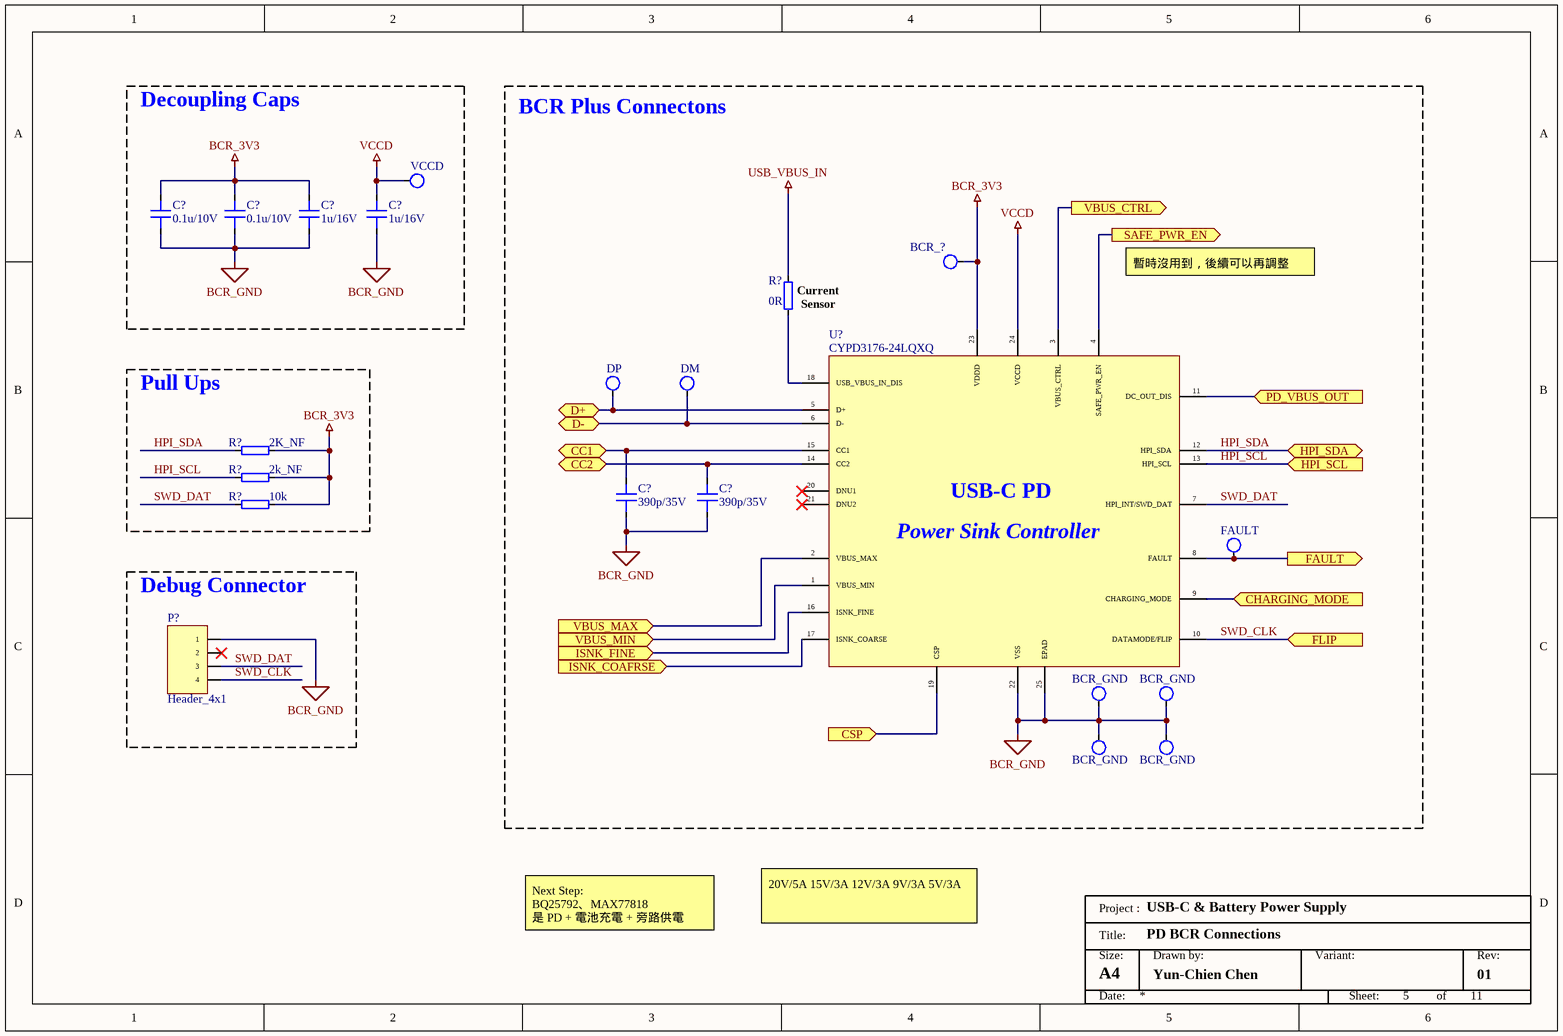
[diagram p5: PD_BCR_Connections.SchDoc]

### Parts
(Parts that share a designator on the sheet are numbered #1, #2 ... from top to bottom, then left to right.)
BCR_?#1  DIP_small_Red  [TestPoint_dip_big]  (value not drawn)
BCR_GND#1  DIP_small_Black  [TestPoint_dip_small]  (value not drawn)
BCR_GND#2  DIP_small_Black  [TestPoint_dip_small]  (value not drawn)
BCR_GND#3  DIP_small_Black  [TestPoint_dip_small]  (value not drawn)
BCR_GND#4  DIP_small_Black  [TestPoint_dip_small]  (value not drawn)
C?#19  0.1u/10V  [0805_Cap]
C?#20  0.1u/10V  [0805_Cap]
C?#21  1u/16V  [0805_Cap]
C?#22  1u/16V  [0805_Cap]
C?#23  390p/35V  [0805_Cap]
C?#24  390p/35V  [0805_Cap]
DM  SMD_25mil  [TestPoint_dip_big]  (value not drawn)
DP  SMD_25mil  [TestPoint_dip_big]  (value not drawn)
FAULT  SMD_25mil  [TestPoint_dip_big]  (value not drawn)
P?#3  Header_4x1  [XT60PW-M]
R?#30  0R  [0603_Res]
R?#31  2K_NF  [0603_Res]
R?#32  2k_NF  [0603_Res]
R?#33  10k  [0603_Res]
U?#2  CYPD3176-24LQXQ  [QFN-24]
VCCD  SMD_25mil  [TestPoint_dip_big]  (value not drawn)

### Blocks framed on the sheet
Decoupling Caps: C?#19-C?#22 VCCD
BCR Plus Connectons: BCR_?#1 BCR_GND#1-BCR_GND#4 C?#23 C?#24 DM DP FAULT R?#30 U?#2
Pull Ups: R?#31-R?#33
Debug Connector: P?#3

### Ports
CC1 (bidir), CC2 (bidir), CHARGING_MODE (in), CSP (in), D+ (bidir), D- (bidir), FAULT (out), FLIP (in), HPI_SCL (in), HPI_SDA (bidir), ISNK_COAFRSE (in), ISNK_FINE (in), PD_VBUS_OUT (in), SAFE_PWR_EN (out), VBUS_CTRL (out), VBUS_MAX (in), VBUS_MIN (in)

### Nets
BCR_3V3: BCR_?#1.1 C?#19.1 C?#20.1 C?#21.1 R?#31.2 R?#32.2 R?#33.2 U?#2.23(VDDD)
BCR_GND: BCR_GND#1.1 BCR_GND#2.1 BCR_GND#3.1 BCR_GND#4.1 C?#19.2 C?#20.2 C?#21.2 C?#22.2 C?#23.2 C?#24.2 P?#3.1 U?#2.22(VSS) U?#2.25(EPAD)
PD_VBUS_IN: U?#2.11(DC_OUT_DIS) ; port PD_VBUS_OUT
RETURN_GND: U?#2.19(CSP) ; port CSP
USB_VBUS_IN: R?#30.1
VCCD: C?#22.1 U?#2.24(VCCD) VCCD.1
CC1: C?#23.1 U?#2.15(CC1) ; port CC1
CC2: C?#24.1 U?#2.14(CC2) ; port CC2
CHARGING_MODE: U?#2.9(CHARGING_MODE) ; port CHARGING_MODE
D+: DP.1 U?#2.5(D+) ; port D+
D-: DM.1 U?#2.6(D-) ; port D-
FAULT: FAULT.1 U?#2.8(FAULT) ; port FAULT
HPI_SCL: R?#32.1 U?#2.13(HPI_SCL) ; port HPI_SCL
HPI_SDA: R?#31.1 U?#2.12(HPI_SDA) ; port HPI_SDA
ISNK_COAFRSE: U?#2.17(ISNK_COARSE) ; port ISNK_COAFRSE
ISNK_FINE: U?#2.16(ISNK_FINE) ; port ISNK_FINE
SAFE_PWR_EN: U?#2.4(SAFE_PWR_EN) ; port SAFE_PWR_EN
SWD_CLK: P?#3.4 U?#2.10(DATAMODE/FLIP) ; port FLIP
SWD_DAT: P?#3.3 R?#33.1 U?#2.7(HPI_INT/SWD_DAT)
VBUS_CTRL: U?#2.3(VBUS_CTRL) ; port VBUS_CTRL
VBUS_MAX: U?#2.2(VBUS_MAX) ; port VBUS_MAX
VBUS_MIN: U?#2.1(VBUS_MIN) ; port VBUS_MIN
NetR?#30_2: R?#30.2 U?#2.18(USB_VBUS_IN_DIS)

Not connected (* = marked no-connect by the designer): P?#3 2*; U?#2 20(DNU1)* 21(DNU2)*

### Notes on the sheet
- (near R?#30) Current
  Sensor
- 暫時沒用到，後續可以再調整
- Next Step:
  BQ25792、MAX77818
  是 PD + 電池充電 + 旁路供電
- 20V/5A 15V/3A 12V/3A 9V/3A 5V/3A
- Project :
- Size:
- Title:
- Drawn by:
- Variant:
- Rev:
- Date:
- Sheet:
- of
- (in symbol CYPD3176-24LQXQ) USB-C PD; Power Sink Controller

### Library data of the parts
BCR_?#1 BCR_GND#1-BCR_GND#4 DM DP FAULT VCCD = Test_Point: General test point; Mfr. #: N/A; Mfr.: N/A; Distributor_Link: N/A; Datasheet: N/A; Distributor #: N/A
C?#19-C?#24 = Cap: General capacitor (non-polarized); Mfr. #: *; Mfr.: *; Distributor_Link: *; Datasheet: *; Distributor #: *
P?#3 = Header_4x1: General header 4x1; Mfr. #: *; Mfr.: *; Distributor_Link: *; Datasheet: *; Distributor #: *
R?#30 = Res: Thick Film Resistors - SMD 0Ohm 0805 31.6A Jumper Hi Curr; Mfr. #: *; Mfr.: *; Distributor_Link: *; Datasheet: *; Distributor #: *
R?#31-R?#33 = Res: General Resistor; Mfr. #: *; Mfr.: *; Distributor_Link: *; Datasheet: *; Distributor #: *
U?#2 = CYPD3176-24LQXQ: USB Interface IC USB Type-C port controller (BCR-PLUS) CYPD3176; Mfr. #: CYPD3176-24LQXQT; Mfr.: Infineon Technologies; Distributor_Link: https://www.mouser.tw/ProductDetail/Infineon-Technologies/CYPD3176-24LQXQT?qs=A6eO%252BMLsxmQEa4cjIEO1Eg%3D%3D; Datasheet: https://www.mouser.tw/datasheet/2/196/Infineon_CYPD3176_24LQXQ_DataSheet_v01_00_EN-3161635.pdf; Distributor #: 727-CYPD3176-24LQXQT

## Sheet Battery_and_Bypass_Controller_Connectons.SchDoc: Battery and Bypass Controller Connectons
size 292 x 193 mm; SheetNumber: 8; SheetTotal: 11; SPICEModelCacheMGYABEQD: <root> / <DocumentId>MGYABEQD</DocumentId> / </root>; SheetSize: A4
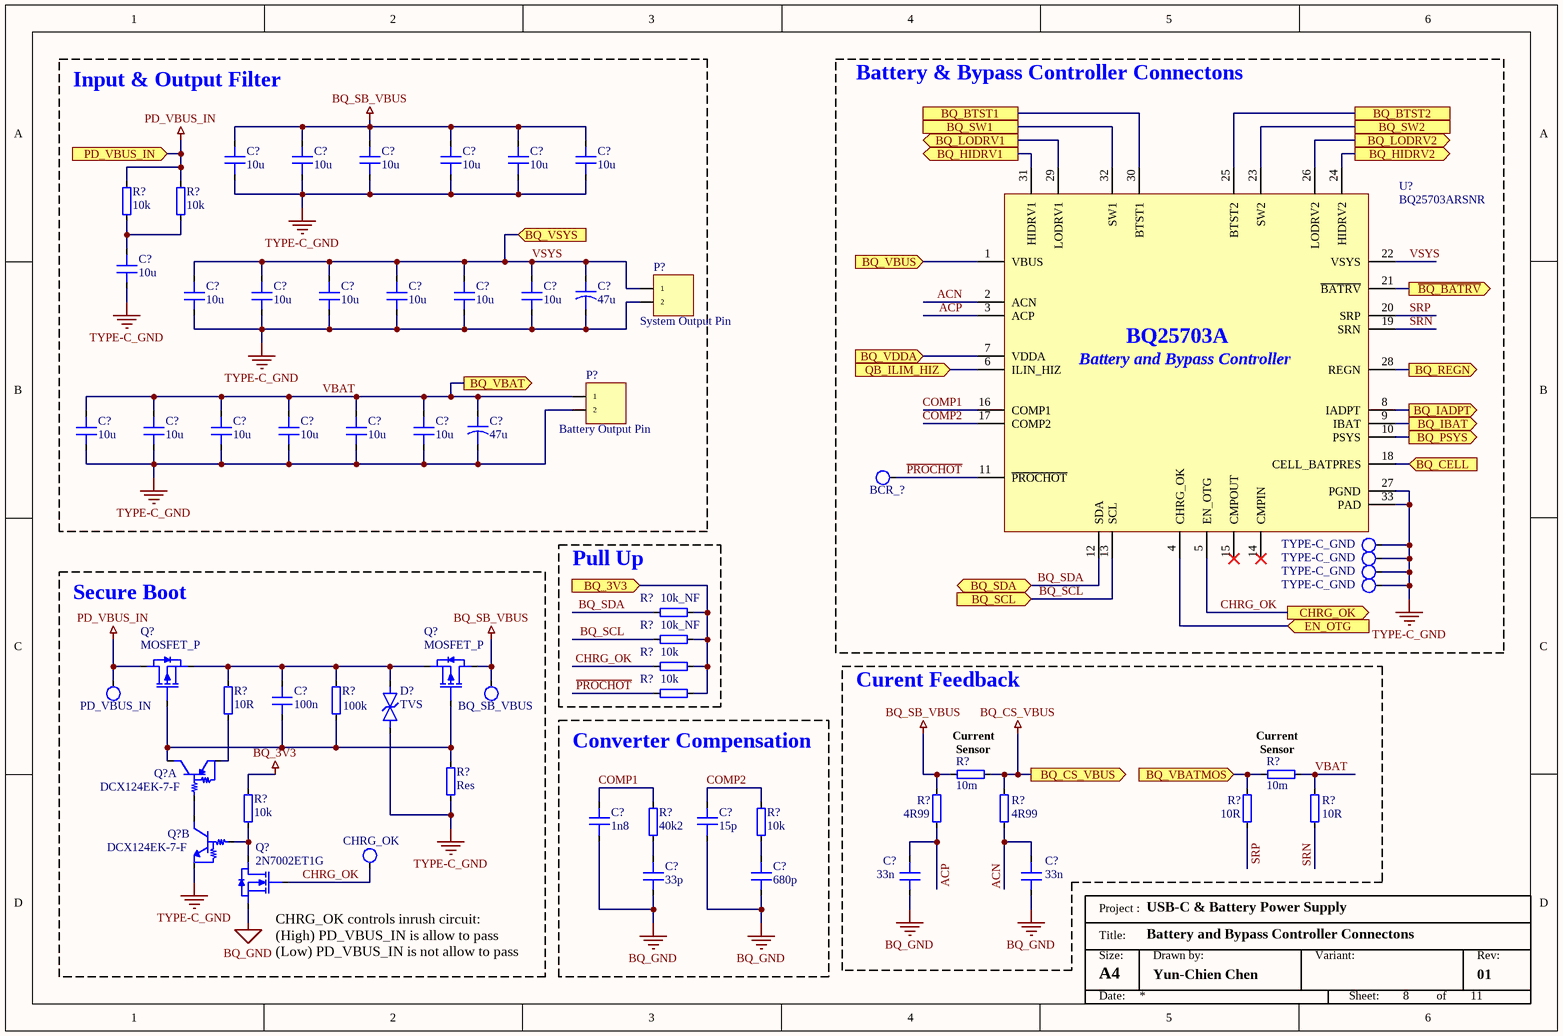
[diagram p6: Battery_and_Bypass_Controller_Connectons.SchDoc]

### Parts
(Parts that share a designator on the sheet are numbered #1, #2 ... from top to bottom, then left to right.)
BCR_?#2  SMD_25mil  [TestPoint_smd_25mil]  (value not drawn)
BQ_SB_VBUS  SMD_25mil  [TestPoint_smd_25mil]  (value not drawn)
C?#25  10u  [0805_Cap]
C?#26  10u  [0805_Cap]
C?#27  10u  [0805_Cap]
C?#28  10u  [0805_Cap]
C?#29  10u  [0805_Cap]
C?#30  10u  [0805_Cap]
C?#31  47u
C?#32  10u  [0805_Cap]
C?#33  10u  [0805_Cap]
C?#34  10u  [0805_Cap]
C?#35  10u  [0805_Cap]
C?#36  10u  [0805_Cap]
C?#37  10u  [0805_Cap]
C?#38  10u  [0805_Cap]
C?#39  47u
C?#40  10u  [0805_Cap]
C?#41  10u  [0805_Cap]
C?#42  10u  [0805_Cap]
C?#43  10u  [0805_Cap]
C?#44  10u  [0805_Cap]
C?#45  10u  [0805_Cap]
C?#46  100n  [0805_Cap]
C?#47  1n8  [0805_Cap]
C?#48  15p  [0805_Cap]
C?#49  33p  [0805_Cap]
C?#50  680p  [0805_Cap]
C?#51  33n  [0805_Cap]
C?#52  33n  [0805_Cap]
CHRG_OK#1  SMD_25mil  [TestPoint_smd_25mil]  (value not drawn)
D?#12  TVS  [SOD-523]
P?#4  System Output Pin  [XT60PW-M]
P?#5  Battery Output Pin  [XT60PW-M]
PD_VBUS_IN  SMD_25mil  [TestPoint_smd_25mil]  (value not drawn)
Q?#4  MOSFET_P  [SOT-523-3]
Q?#5  MOSFET_P  [SOT-523-3]
Q?#6  DCX124EK-7-F  [SOT-26]  (part A of 2)
Q?#7  2N7002ET1G  [SOT-523-3]
Q?#8  DCX124EK-7-F  [SOT-26]  (part B of 2)
R?#34  10k  [0603_Res]
R?#35  10k  [0603_Res]
R?#36  10k_NF  [0603_Res]
R?#37  10k_NF  [0603_Res]
R?#38  10k  [0603_Res]
R?#39  10R  [0603_Res]
R?#40  100k  [0603_Res]
R?#41  10k  [0603_Res]
R?#42  Res  [0603_Res]
R?#43  10m  [0603_Res]
R?#44  10m  [0603_Res]
R?#45  10k  [0603_Res]
R?#46  4R99  [0603_Res]
R?#47  4R99  [0603_Res]
R?#48  10R  [0603_Res]
R?#49  10R  [0603_Res]
R?#50  40k2  [0603_Res]
R?#51  10k  [0603_Res]
TYPE-C_GND#1  SMD_25mil  [TestPoint_smd_25mil]  (value not drawn)
TYPE-C_GND#2  SMD_25mil  [TestPoint_smd_25mil]  (value not drawn)
TYPE-C_GND#3  SMD_25mil  [TestPoint_smd_25mil]  (value not drawn)
TYPE-C_GND#4  SMD_25mil  [TestPoint_smd_25mil]  (value not drawn)
U?#3  BQ25703ARSNR  [WQFN-32]

### Blocks framed on the sheet
Input & Output Filter: C?#25-C?#45 P?#4 P?#5 R?#34 R?#35
Battery & Bypass Controller Connectons: BCR_?#2 TYPE-C_GND#1-TYPE-C_GND#4 U?#3
Pull Up: R?#36-R?#38 R?#41
Secure Boot: BQ_SB_VBUS C?#46 CHRG_OK#1 D?#12 PD_VBUS_IN Q?#4-Q?#8 R?#39 R?#40 R?#42 R?#45
Curent Feedback: C?#51 C?#52 R?#43 R?#44 R?#46-R?#49
Converter Compensation: C?#47-C?#50 R?#50 R?#51

### Ports
BQ_3V3 (in), BQ_BTST1, BQ_BTST2, BQ_CELL (in), BQ_CS_VBUS (out), BQ_HIDRV1 (out), BQ_HIDRV2 (out), BQ_IADPT (out), BQ_IBAT (out), BQ_LODRV1 (out), BQ_LODRV2 (out), BQ_PSYS (out), BQ_REGN (out), BQ_SCL (in), BQ_SDA (bidir), BQ_SW1, BQ_SW2, BQ_VBAT (out), BQ_VBATMOS (in), BQ_VBUS (in), BQ_VDDA (in), BQ_VSYS (in), CHRG_OK (out), EN_OTG (in), PD_VBUS_IN (in), QB_ILIM_HIZ (in), ~{BQ_BATRV} (out)

### Nets
BQ_3V3: R?#36.2 R?#37.1 R?#38.1 R?#41.1 R?#45.1 ; port BQ_3V3
BQ_CS_VBUS: R?#43.2 R?#47.1 ; port BQ_CS_VBUS
BQ_GND: C?#47.2 C?#48.2 C?#49.1 C?#50.1 C?#51.1 C?#52.1 Q?#7.3(S)
BQ_SB_VBUS: BQ_SB_VBUS.1 C?#25.1 C?#26.1 C?#27.1 C?#28.1 C?#29.1 C?#30.1 Q?#5.1(D1) R?#43.1 R?#46.1
PD_VBUS_IN: PD_VBUS_IN.1 Q?#4.1(D1) R?#34.2 R?#35.2 ; port PD_VBUS_IN
TYPE-C_GND: C?#25.2 C?#26.2 C?#27.2 C?#28.2 C?#29.2 C?#30.2 C?#31.2 C?#32.1 C?#33.1 C?#34.1 C?#35.1 C?#36.1 C?#37.1 C?#38.1 C?#39.2 C?#40.1 C?#41.1 C?#42.1 C?#43.1 C?#44.1 C?#45.1 D?#12.2(K) P?#4.2 P?#5.2 Q?#8.6(E2) R?#42.2 TYPE-C_GND#1.1 TYPE-C_GND#2.1 TYPE-C_GND#3.1 TYPE-C_GND#4.1 U?#3.27(PGND) U?#3.33(PAD)
~{BQ_BATRV}: U?#3.21(~{BATRV}) ; port ~{BQ_BATRV}
~{PROCHOT}: BCR_?#2.1 R?#41.2 U?#3.11(~{PROCHOT})
ACN: C?#52.2 R?#47.2 U?#3.2(ACN)
ACP: C?#51.2 R?#46.2 U?#3.3(ACP)
BQ_BTST1: U?#3.30(BTST1) ; port BQ_BTST1
BQ_BTST2: U?#3.25(BTST2) ; port BQ_BTST2
BQ_CELL: U?#3.18(CELL_BATPRES) ; port BQ_CELL
BQ_HIDRV1: U?#3.31(HIDRV1) ; port BQ_HIDRV1
BQ_HIDRV2: U?#3.24(HIDRV2) ; port BQ_HIDRV2
BQ_IADPT: U?#3.8(IADPT) ; port BQ_IADPT
BQ_IBAT: U?#3.9(IBAT) ; port BQ_IBAT
BQ_LODRV1: U?#3.29(LODRV1) ; port BQ_LODRV1
BQ_LODRV2: U?#3.26(LODRV2) ; port BQ_LODRV2
BQ_PSYS: U?#3.10(PSYS) ; port BQ_PSYS
BQ_REGN: U?#3.28(REGN) ; port BQ_REGN
BQ_SCL: R?#37.2 U?#3.13(SCL) ; port BQ_SCL
BQ_SDA: R?#36.1 U?#3.12(SDA) ; port BQ_SDA
BQ_SW1: U?#3.32(SW1) ; port BQ_SW1
BQ_SW2: U?#3.23(SW2) ; port BQ_SW2
BQ_VBATMOS: R?#44.1 R?#48.1 ; port BQ_VBATMOS
BQ_VBUS: U?#3.1(VBUS) ; port BQ_VBUS
CHRG_OK: CHRG_OK#1.1 Q?#7.2(G) R?#38.2 U?#3.5(EN_OTG) ; port CHRG_OK
COMP1: C?#47.1 R?#50.2 U?#3.16(COMP1)
COMP2: C?#48.1 R?#51.2 U?#3.17(COMP2)
EN_OTG: U?#3.4(CHRG_OK) ; port EN_OTG
QB_ILIM_HIZ: U?#3.6(ILIN_HIZ) ; port QB_ILIM_HIZ
SRN: R?#49.2 U?#3.19(SRN)
SRP: R?#48.2 U?#3.20(SRP)
VBAT: C?#39.1 C?#40.2 C?#41.2 C?#42.2 C?#43.2 C?#44.2 C?#45.2 P?#5.1 R?#44.2 R?#49.1 ; port BQ_VBAT
VDDA: U?#3.7(VDDA) ; port BQ_VDDA
VSYS: C?#31.1 C?#33.2 C?#34.2 C?#35.2 C?#36.2 C?#37.2 C?#38.2 P?#4.1 U?#3.22(VSYS) ; port BQ_VSYS
NetC?#32_2: C?#32.2 R?#34.1 R?#35.1
NetC?#46_1: C?#46.1 Q?#4.2(G1) Q?#5.2(G1) Q?#6.4(C1) R?#40.2 R?#42.1
NetC?#46_2: C?#46.2 D?#12.1(A) Q?#4.3(S1) Q?#5.3(S1) R?#39.1 R?#40.1
NetC?#49_2: C?#49.2 R?#50.1
NetC?#50_2: C?#50.2 R?#51.1
NetQ?#6_1: Q?#6.1(E1) R?#39.2
NetQ?#6_2: Q?#6.2(B1) Q?#8.3(C2)
NetQ?#7_1: Q?#7.1(D) Q?#8.5(B2) R?#45.2

Not connected (* = marked no-connect by the designer): U?#3 14(CMPIN)* 15(CMPOUT)*

### Notes on the sheet
- (near R?#43) Current
  Sensor
- (near R?#44) Current
  Sensor
- (near Q?#7) CHRG_OK controls inrush circuit:
  (High) PD_VBUS_IN is allow to pass
  (Low) PD_VBUS_IN is not allow to pass
- Project :
- Size:
- Title:
- Drawn by:
- Variant:
- Rev:
- Date:
- Sheet:
- of
- (in symbol BQ25703ARSNR) BQ25703A; Battery and Bypass Controller

### Library data of the parts
BCR_?#2 BQ_SB_VBUS CHRG_OK#1 PD_VBUS_IN TYPE-C_GND#1-TYPE-C_GND#4 = Test_Point: General test point; Mfr. #: N/A; Mfr.: N/A; Distributor_Link: N/A; Datasheet: N/A; Distributor #: N/A
C?#25-C?#30 C?#32-C?#38 C?#40-C?#52 = Cap: General capacitor (non-polarized); Mfr. #: *; Mfr.: *; Distributor_Link: *; Datasheet: *; Distributor #: *
C?#31 C?#39 = Cap_2: General capacitor (with polarity); Mfr. #: *; Mfr.: *; Distributor_Link: *; Datasheet: *; Distributor #: *
D?#12 = TVS: General TVS; Mfr. #: *; Mfr.: *; Distributor_Link: *; Datasheet: *; Distributor #: *
P?#4 = Header_2x1: Battery Output Pin; Mfr. #: *; Mfr.: *; Distributor_Link: *; Datasheet: *; Distributor #: *
P?#5 = Header_2x1: Mfr. #: *; Mfr.: *; Distributor_Link: *; Datasheet: *; Distributor #: *
Q?#4 Q?#5 = MOSFET_P: General p channel mosfet; Mfr. #: *; Mfr.: *; Distributor_Link: *; Datasheet: *; Distributor #: *
Q?#6 Q?#8 = DCX124EK-7-F: Bipolar Transistors - Pre-Biased PREBIASED TRANSISTOR SOT-26 300MW; Mfr.: Diodes Incorporated; Mfr. #: DCX124EK-7-F; Distributor_Link: https://www.mouser.tw/ProductDetail/Diodes-Incorporated/DCX124EK-7-F?qs=oVWkMaT70e5dmImuN6ueZA%3D%3D; Datasheet: https://www.diodes.com/assets/Datasheets/ds30350.pdf; Distributor #: 621-DCX124EK-7-F
Q?#7 = MOSFET_N: General n channel mosfet; Mfr. #: *; Mfr.: *; Distributor_Link: *; Datasheet: *; Distributor #: *
R?#34-R?#51 = Res: General Resistor; Mfr. #: *; Mfr.: *; Distributor_Link: *; Datasheet: *; Distributor #: *
U?#3 = BQ25703ARSNR: Battery Management I2C 1-4 cell NVDC Buck-Boost battery charge controller with system power monitor & processor 32-QFN -40 to 85; Mfr.: Texas Instruments; Distributor_Link: https://www.mouser.tw/ProductDetail/Texas-Instruments/BQ25703ARSNR?qs=5aG0NVq1C4wREUY%2F32PenQ%3D%3D; Mfr. #: BQ25703ARSNR; Datasheet: https://www.ti.com/general/docs/suppproductinfo.tsp?distId=26&gotoUrl=https://www.ti.com/lit/gpn/bq25703a; Distributor #: 595-BQ25703ARSNR

## Sheet Voltage_Regulator_and_Load_Connectors.SchDoc: Voltage Regulator & Load Connectors
size 292 x 193 mm; SheetNumber: 10; SheetTotal: 12; SheetSize: A4

### Notes on the sheet
- Project :
- Size:
- Title:
- Drawn by:
- Variant:
- Rev:
- Date:
- Sheet:
- of

## Sheet Battery_Charging_and_Bypass_Power_Supply.SchDoc: Battery Charging & Bypass Power Supply
size 292 x 193 mm; SheetNumber: 9; SheetTotal: 11; SheetSize: A4
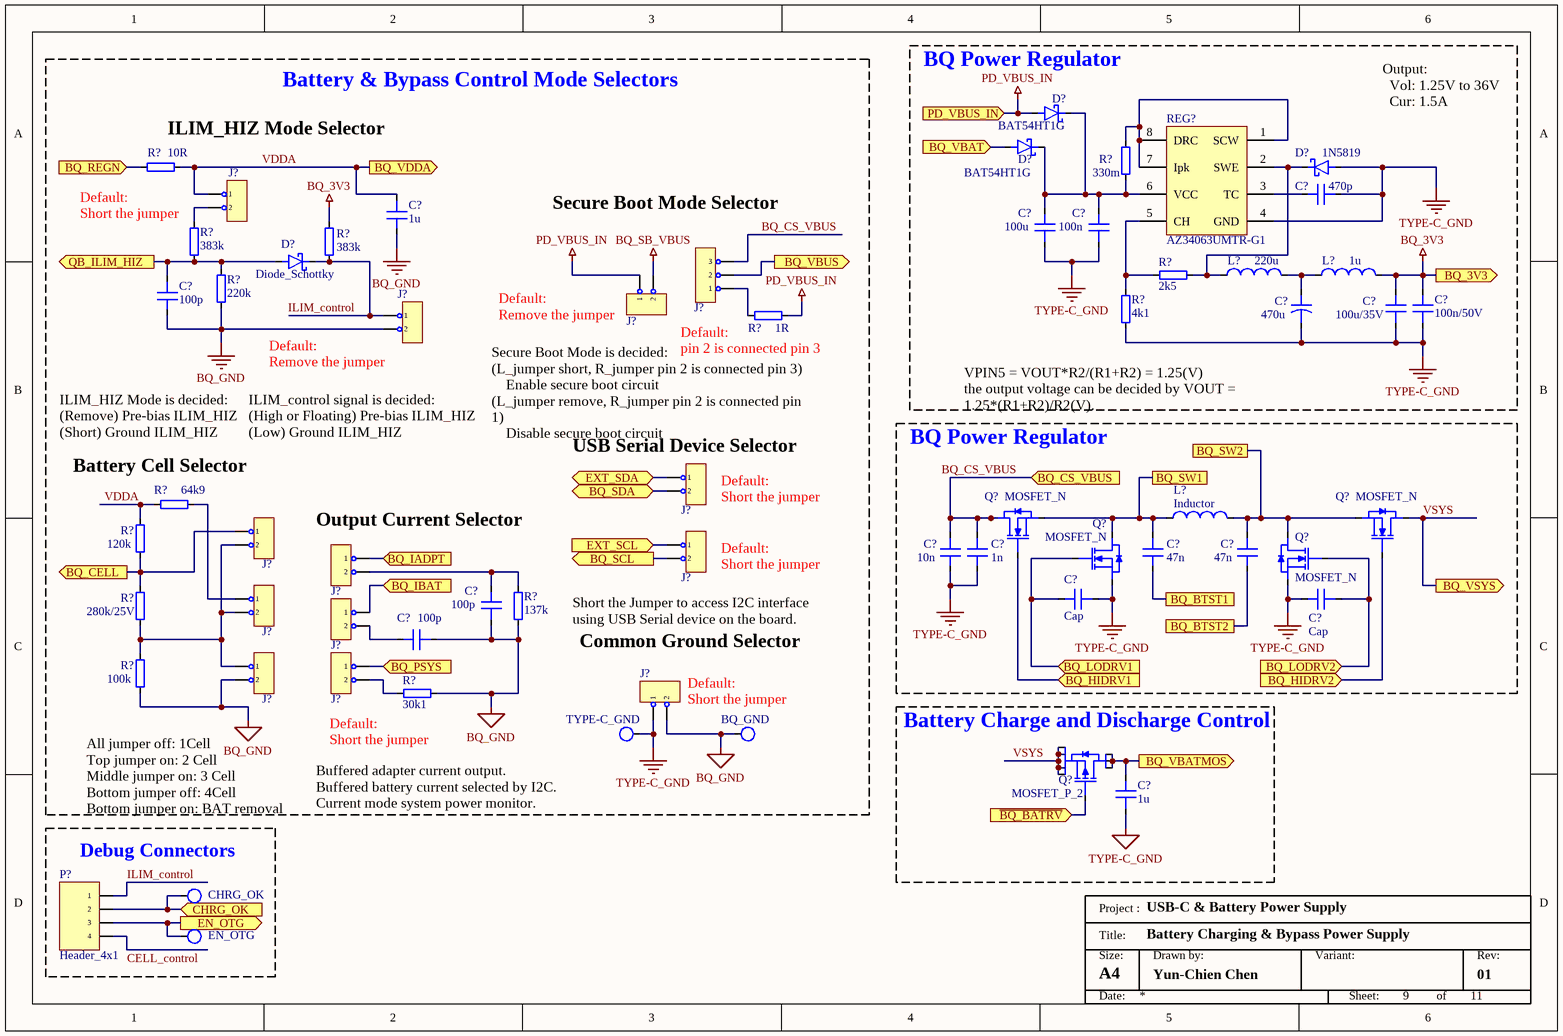
[diagram p7: Battery_Charging_and_Bypass_Power_Supply.SchDoc]

### Parts
(Parts that share a designator on the sheet are numbered #1, #2 ... from top to bottom, then left to right.)
BQ_GND  SMD_25mil  [TestPoint_smd_25mil]  (value not drawn)
C?#53  470p  [0805_Cap]
C?#54  100u  [0805_Cap]
C?#55  100n  [0805_Cap]
C?#56  1u  [0805_Cap]
C?#57  470u
C?#58  100u/35V  [0805_Cap]
C?#59  100n/50V  [0805_Cap]
C?#60  100p  [0805_Cap]
C?#61  10n  [0805_Cap]
C?#62  1n  [0805_Cap]
C?#63  47n  [0805_Cap]
C?#64  47n  [0805_Cap]
C?#65  100p  [0805_Cap]
C?#66  Cap  [0805_Cap]
C?#67  Cap  [0805_Cap]
C?#68  100p  [0805_Cap]
C?#69  1u  [0805_Cap]
CHRG_OK#2  SMD_25mil  [TestPoint_smd_25mil]  (value not drawn)
D?#13  BAT54HT1G
D?#14  BAT54HT1G
D?#15  1N5819
D?#16  Diode_Schottky
EN_OTG  SMD_25mil  [TestPoint_smd_25mil]  (value not drawn)
J?#9  Jumper_2x1  [Dupont_Header_(male)_2.54_2x1]  (value not drawn)
J?#10  Jumper_2x1  [Dupont_Header_(male)_2.54_2x1]  (value not drawn)
J?#11  Jumper_3x1  [Dupont_Header_(male)_2.54_3x1]  (value not drawn)
J?#12  Jumper_2x1  [Dupont_Header_(male)_2.54_2x1]  (value not drawn)
J?#13  Jumper_2x1  [Dupont_Header_(male)_2.54_2x1]  (value not drawn)
J?#14  Jumper_2x1  [Dupont_Header_(male)_2.54_2x1]  (value not drawn)
J?#15  Jumper_2x1  [Dupont_Header_(male)_2.54_2x1]  (value not drawn)
J?#16  Jumper_2x1  [Dupont_Header_(male)_2.54_2x1]  (value not drawn)
J?#17  Jumper_2x1  [Dupont_Header_(male)_2.54_2x1]  (value not drawn)
J?#18  Jumper_2x1  [Dupont_Header_(male)_2.54_2x1]  (value not drawn)
J?#19  Jumper_2x1  [Dupont_Header_(male)_2.54_2x1]  (value not drawn)
J?#20  Jumper_2x1  [Dupont_Header_(male)_2.54_2x1]  (value not drawn)
J?#21  Jumper_2x1  [Dupont_Header_(male)_2.54_2x1]  (value not drawn)
L?#3  220u  [1212_Ind]
L?#4  1u  [1212_Ind]
L?#5  Inductor  [1212_Ind]
P?#6  Header_4x1  [XT60PW-M]
Q?#9  MOSFET_N  [SOT-523-3]
Q?#10  MOSFET_N  [SOT-523-3]
Q?#11  MOSFET_N  [SOT-523-3]
Q?#12  MOSFET_N  [SOT-523-3]
Q?#13  MOSFET_P_2  [VSONP-8]
R?#52  330m  [0603_Res]
R?#53  10R  [0603_Res]
R?#54  383k  [0603_Res]
R?#55  383k  [0603_Res]
R?#56  220k  [0603_Res]
R?#57  2k5  [0603_Res]
R?#58  1R  [0603_Res]
R?#59  4k1  [0603_Res]
R?#60  64k9  [0603_Res]
R?#61  120k  [0603_Res]
R?#62  280k/25V  [0603_Res]
R?#63  137k  [0603_Res]
R?#64  100k  [0603_Res]
R?#65  30k1  [0603_Res]
REG?#2  AZ34063UMTR-G1  [SOIC-8]
TYPE-C_GND#5  SMD_25mil  [TestPoint_smd_25mil]  (value not drawn)

### Blocks framed on the sheet
Battery & Bypass Control Mode Selectors: BQ_GND C?#56 C?#60 C?#65 C?#68 D?#16 J?#9-J?#21 R?#53-R?#56 R?#58 R?#60-R?#65 TYPE-C_GND#5
BQ Power Regulator: C?#53-C?#55 C?#57-C?#59 D?#13-D?#15 L?#3 L?#4 R?#52 R?#57 R?#59 REG?#2
BQ Power Regulator: C?#61-C?#64 C?#66 C?#67 L?#5 Q?#9-Q?#12
Battery Charge and Discharge Control: C?#69 Q?#13
Debug Connectors: CHRG_OK#2 EN_OTG P?#6

### Ports
BQ_3V3 (out), BQ_BTST1, BQ_BTST2, BQ_CELL (out), BQ_CS_VBUS (in), BQ_HIDRV1 (in), BQ_HIDRV2 (in), BQ_IADPT (in), BQ_IBAT (in), BQ_LODRV1 (in), BQ_LODRV2 (in), BQ_PSYS (in), BQ_REGN (in), BQ_SCL (out), BQ_SDA (bidir), BQ_SW1, BQ_SW2, BQ_VBAT (in), BQ_VBATMOS (out), BQ_VBUS (out), BQ_VDDA (out), BQ_VSYS (out), CHRG_OK (in), EN_OTG (out), EXT_SCL (in), EXT_SDA (bidir), PD_VBUS_IN (in), QB_ILIM_HIZ (out), ~{BQ_BATRV} (in)

### Nets
BQ_3V3: C?#58.1 C?#59.1 L?#4.2 R?#55.2 ; port BQ_3V3
BQ_CS_VBUS: C?#61.2 C?#62.2 J?#11.3 Q?#9.1(D) ; port BQ_CS_VBUS
BQ_GND: BQ_GND.1 C?#56.1 C?#60.1 C?#65.2 C?#68.2 J?#10.2 J?#19.2 J?#21.2 R?#56.2 R?#63.1 R?#64.1 R?#65.1
BQ_SB_VBUS: J?#12.2
PD_VBUS_IN: D?#13.1(A) J?#12.1 R?#58.2 ; port PD_VBUS_IN
TYPE-C_GND: C?#53.2 C?#54.2 C?#55.2 C?#57.2 C?#58.2 C?#59.2 C?#61.1 C?#62.1 C?#66.2 C?#67.1 C?#69.2 D?#15.1(A) J?#21.1 Q?#10.3(S) Q?#11.3(S) R?#59.1 REG?#2.4(GND) TYPE-C_GND#5.1
~{BQ_BATRV}: Q?#13.4(G) ; port ~{BQ_BATRV}
BQ_BTST1: C?#63.1 ; port BQ_BTST1
BQ_BTST2: C?#64.1 ; port BQ_BTST2
BQ_CELL: J?#14.1 R?#61.1 R?#62.2 ; port BQ_CELL
BQ_HIDRV1: Q?#9.2(G) ; port BQ_HIDRV1
BQ_HIDRV2: Q?#12.2(G) ; port BQ_HIDRV2
BQ_IADPT: J?#16.1 ; port BQ_IADPT
BQ_IBAT: J?#18.1 ; port BQ_IBAT
BQ_LODRV1: C?#66.1 Q?#10.2(G) ; port BQ_LODRV1
BQ_LODRV2: C?#67.2 Q?#11.2(G) ; port BQ_LODRV2
BQ_PSYS: J?#20.1 ; port BQ_PSYS
BQ_REGN: R?#53.1 ; port BQ_REGN
BQ_SCL: J?#15.2 ; port BQ_SCL
BQ_SDA: J?#13.2 ; port BQ_SDA
BQ_SW1: C?#63.2 L?#5.1 Q?#9.3(S) Q?#10.1(D) ; port BQ_SW1
BQ_SW2: C?#64.2 L?#5.2 Q?#11.1(D) Q?#12.3(S) ; port BQ_SW2
BQ_VBATMOS: C?#69.1 Q?#13.1(D1_1) Q?#13.2(D1_2) Q?#13.3(D1_3) ; port BQ_VBATMOS
BQ_VBUS: J?#11.2 ; port BQ_VBUS
CELL_control: P?#6.4
CHRG_OK: CHRG_OK#2.1 P?#6.2 ; port CHRG_OK
EN_OTG: EN_OTG.1 P?#6.3 ; port EN_OTG
I2C2_SCL: J?#15.1 ; port EXT_SCL
I2C2_SDA: J?#13.1 ; port EXT_SDA
ILIM_control: D?#16.2(K) J?#10.1 P?#6.1 R?#55.1
QB_ILIM_HIZ: C?#60.2 D?#16.1(A) R?#54.1 R?#56.1 ; port QB_ILIM_HIZ
VBAT: D?#14.1(A) ; port BQ_VBAT
VDDA: C?#56.2 J?#9.1 R?#53.2 R?#60.2 R?#61.2 ; port BQ_VDDA
VSYS: Q?#12.1(D) Q?#13.5(S1_1) Q?#13.6(S1_2) Q?#13.7(S1_3) Q?#13.8(S1_4) ; port BQ_VSYS
NetC?#53_1: C?#53.1 REG?#2.3(TC)
NetC?#54_1: C?#54.1 C?#55.1 D?#13.2(K) D?#14.2(K) R?#52.2 REG?#2.6(VCC)
NetC?#57_1: C?#57.1 L?#3.2 L?#4.1
NetC?#65_1: C?#65.1 J?#16.2 R?#63.2
NetC?#68_1: C?#68.1 J?#18.2
NetD?#15_2: D?#15.2(K) L?#3.1 R?#57.1 REG?#2.2(SWE)
NetJ?#9_2: J?#9.2 R?#54.2
NetJ?#11_1: J?#11.1 R?#58.1
NetJ?#14_2: J?#14.2 J?#17.2 J?#19.1 R?#62.1 R?#64.2
NetJ?#17_1: J?#17.1 R?#60.1
NetJ?#20_2: J?#20.2 R?#65.2
NetR?#52_1: R?#52.1 REG?#2.1(SCW) REG?#2.7(Ipk) REG?#2.8(DRC)
NetR?#57_2: R?#57.2 R?#59.2 REG?#2.5(CH)

### Notes on the sheet
- Output:
  Vol: 1.25V to 36V
  Cur: 1.5A
- (near R?#53) ILIM_HIZ Mode Selector
- (near R?#54) Default:
  Short the jumper
- (near J?#11) Secure Boot Mode Selector
- (near J?#10) Default:
  Remove the jumper
- (near J?#12) Default:
  Remove the jumper
- (near R?#58) Default:
  pin 2 is connected pin 3
- ILIM_HIZ Mode is decided:
  (Remove) Pre-bias ILIM_HIZ
  (Short) Ground ILIM_HIZ
- ILIM_control signal is decided:
  (High or Floating) Pre-bias ILIM_HIZ
  (Low) Ground ILIM_HIZ
- (near R?#58) Secure Boot Mode is decided:
  (L_jumper short, R_jumper pin 2 is connected pin 3)
  Enable secure boot circuit
  (L_jumper remove, R_jumper pin 2 is connected pin 1)
  Disable secure boot circuit
- VPIN5 = VOUT*R2/(R1+R2) = 1.25(V)
  the output voltage can be decided by VOUT = 1.25*(R1+R2)/R2(V).
- (near R?#60) Battery Cell Selector
- (near J?#13) USB Serial Device Selector
- (near J?#13) Default:
  Short the jumper
- (near J?#16) Output Current Selector
- (near J?#15) Default:
  Short the jumper
- Short the Jumper to access I2C interface using USB Serial device on the board.
- Common Ground Selector
- Default:
  Short the jumper
- All jumper off: 1Cell
  Top jumper on: 2 Cell
  Middle jumper on: 3 Cell
  Bottom jumper off: 4Cell
  Bottom jumper on: BAT removal
- Buffered adapter current output.
  Buffered battery current selected by I2C.
  Current mode system power monitor.
- Project :
- Size:
- Title:
- Drawn by:
- Variant:
- Rev:
- Date:
- Sheet:
- of

### Library data of the parts
BQ_GND CHRG_OK#2 EN_OTG TYPE-C_GND#5 = Test_Point: General test point; Mfr. #: N/A; Mfr.: N/A; Distributor_Link: N/A; Datasheet: N/A; Distributor #: N/A
C?#53-C?#56 C?#58-C?#69 = Cap: General capacitor (non-polarized); Mfr. #: *; Mfr.: *; Distributor_Link: *; Datasheet: *; Distributor #: *
C?#57 = Cap_2: General capacitor (with polarity); Mfr. #: *; Mfr.: *; Distributor_Link: *; Datasheet: *; Distributor #: *
D?#13-D?#16 = Diode_Schottky: General schottky diode; Mfr. #: *; Mfr.: *; Distributor_Link: *; Datasheet: *; Distributor #: *
J?#9 J?#10 J?#12-J?#21 = Jumper_2x1: General Jumper 2x1; Mfr. #: *; Mfr.: *; Distributor_Link: *; Datasheet: *; Distributor #: *
J?#11 = Jumper_3x1: General Jumper 3x1; Mfr. #: *; Mfr.: *; Distributor_Link: *; Datasheet: *; Distributor #: *
L?#3-L?#5 = Inductor: General Inductor; Mfr. #: *; Mfr.: *; Distributor_Link: *; Datasheet: *; Distributor #: *
P?#6 = Header_4x1: General header 4x1; Mfr. #: *; Mfr.: *; Distributor_Link: *; Datasheet: *; Distributor #: *
Q?#9-Q?#12 = MOSFET_N: General n channel mosfet; Mfr. #: *; Mfr.: *; Distributor_Link: *; Datasheet: *; Distributor #: *
Q?#13 = MOSFET_P_2: General p channel mosfet; Mfr. #: *; Mfr.: *; Distributor_Link: *; Datasheet: *; Distributor #: *
R?#52-R?#65 = Res: General Resistor; Mfr. #: *; Mfr.: *; Distributor_Link: *; Datasheet: *; Distributor #: *
REG?#2 = AZ34063UMTR-G1: as REG?#1 on sheet MCU_and_Peripheral_Circuits; Distributor_Link: https://www.mouser.tw/ProductDetail/Diodes-Incorporated/AZ34063UMTR-G1?qs=FKu9oBikfSmOGMlC%2Fa3O3g%3D%3D; Mfr. #: AZ34063UMTR-G1; Datasheet: https://www.diodes.com/assets/Datasheets/AZ34063U.pdf; Distributor #: 621-AZ34063UMTR-G1

## Sheet Revision_History.SchDoc: Revision History
size 292 x 193 mm; SheetNumber: 11; SheetTotal: 12; SheetSize: A4
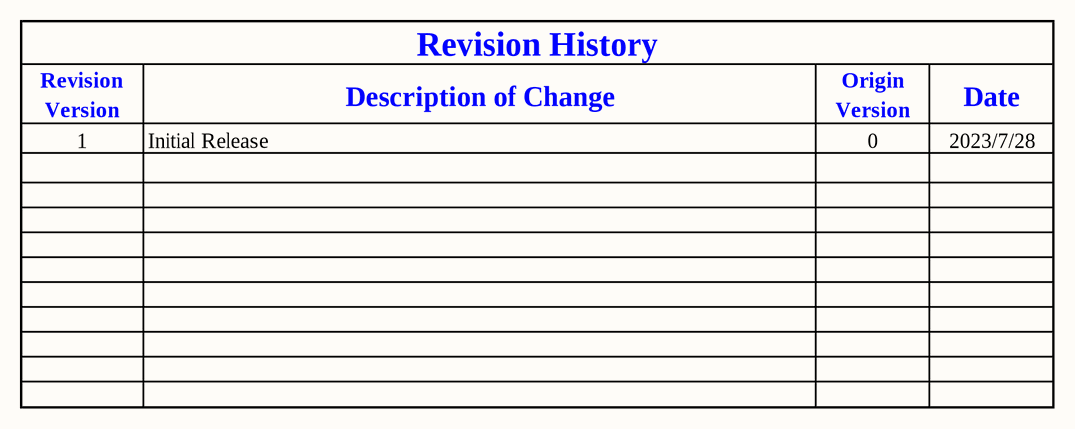
[diagram p8: Revision_History.SchDoc]

### Notes on the sheet
- Project :
- Size:
- Title:
- Drawn by:
- Variant:
- Rev:
- Date:
- Sheet:
- of